# EAGLE design 612_jetracer_esp32s3_030009 (EAGLE 9.6.2)
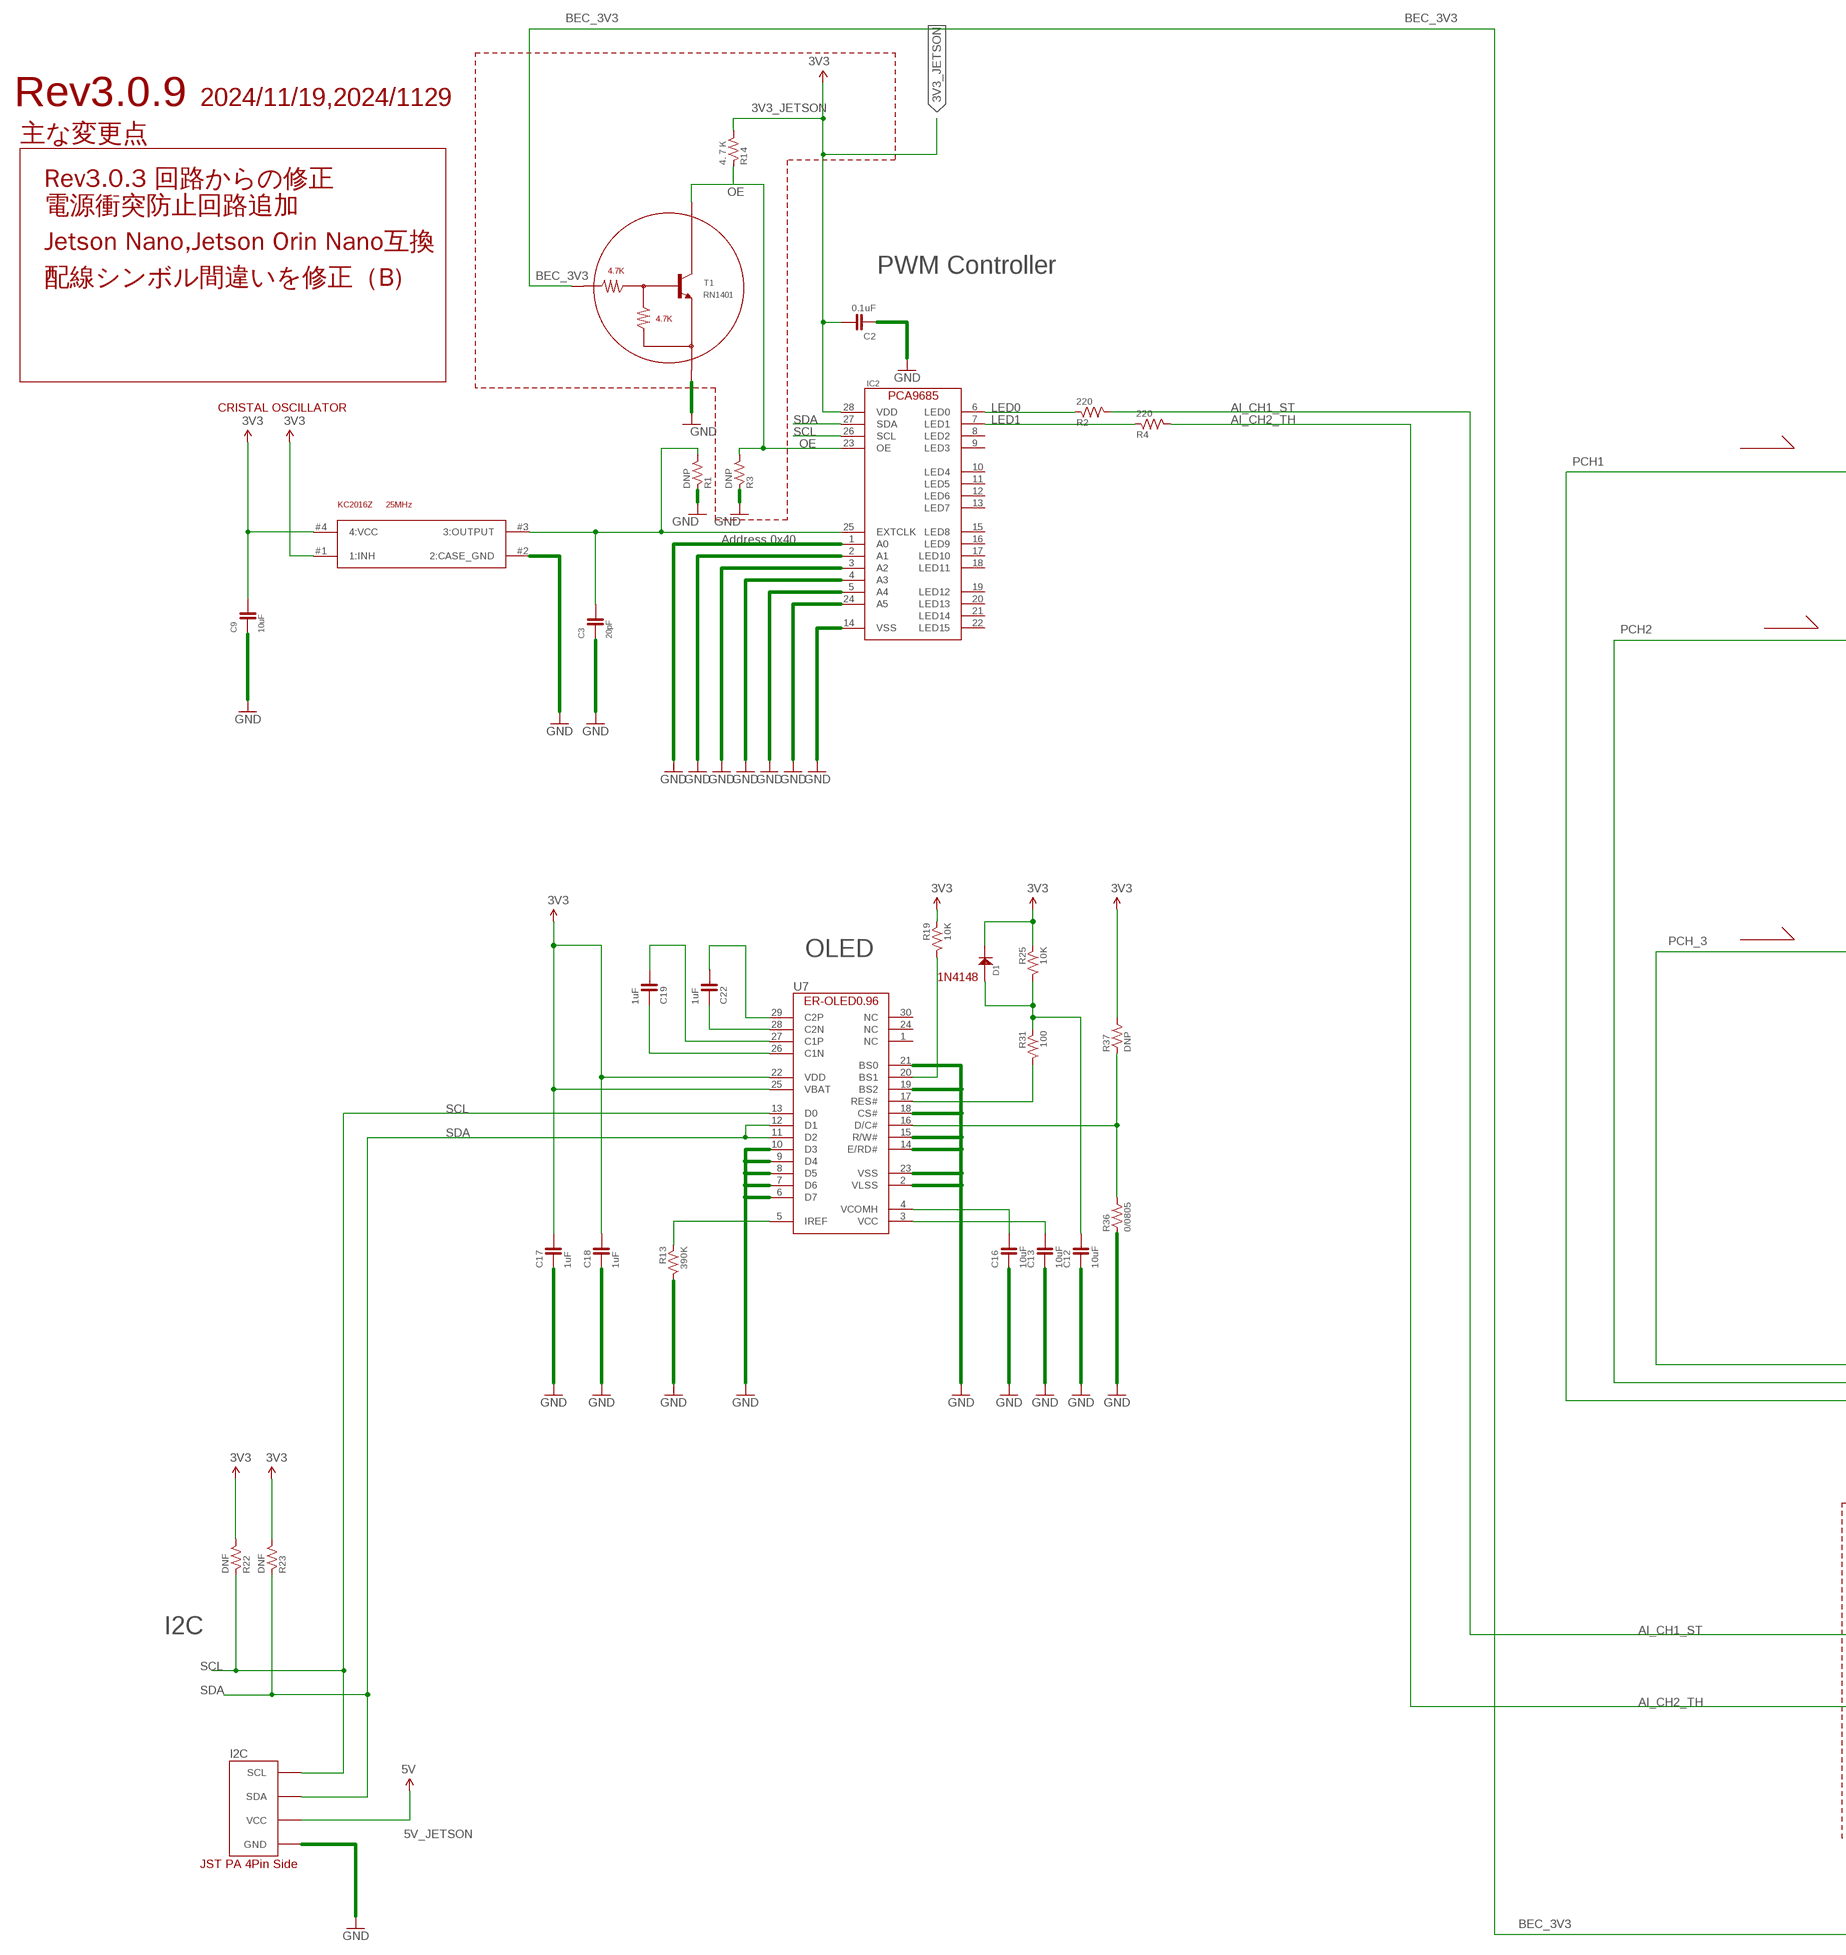
[diagram p0: schematic, sheet 1, part 1 of 3]
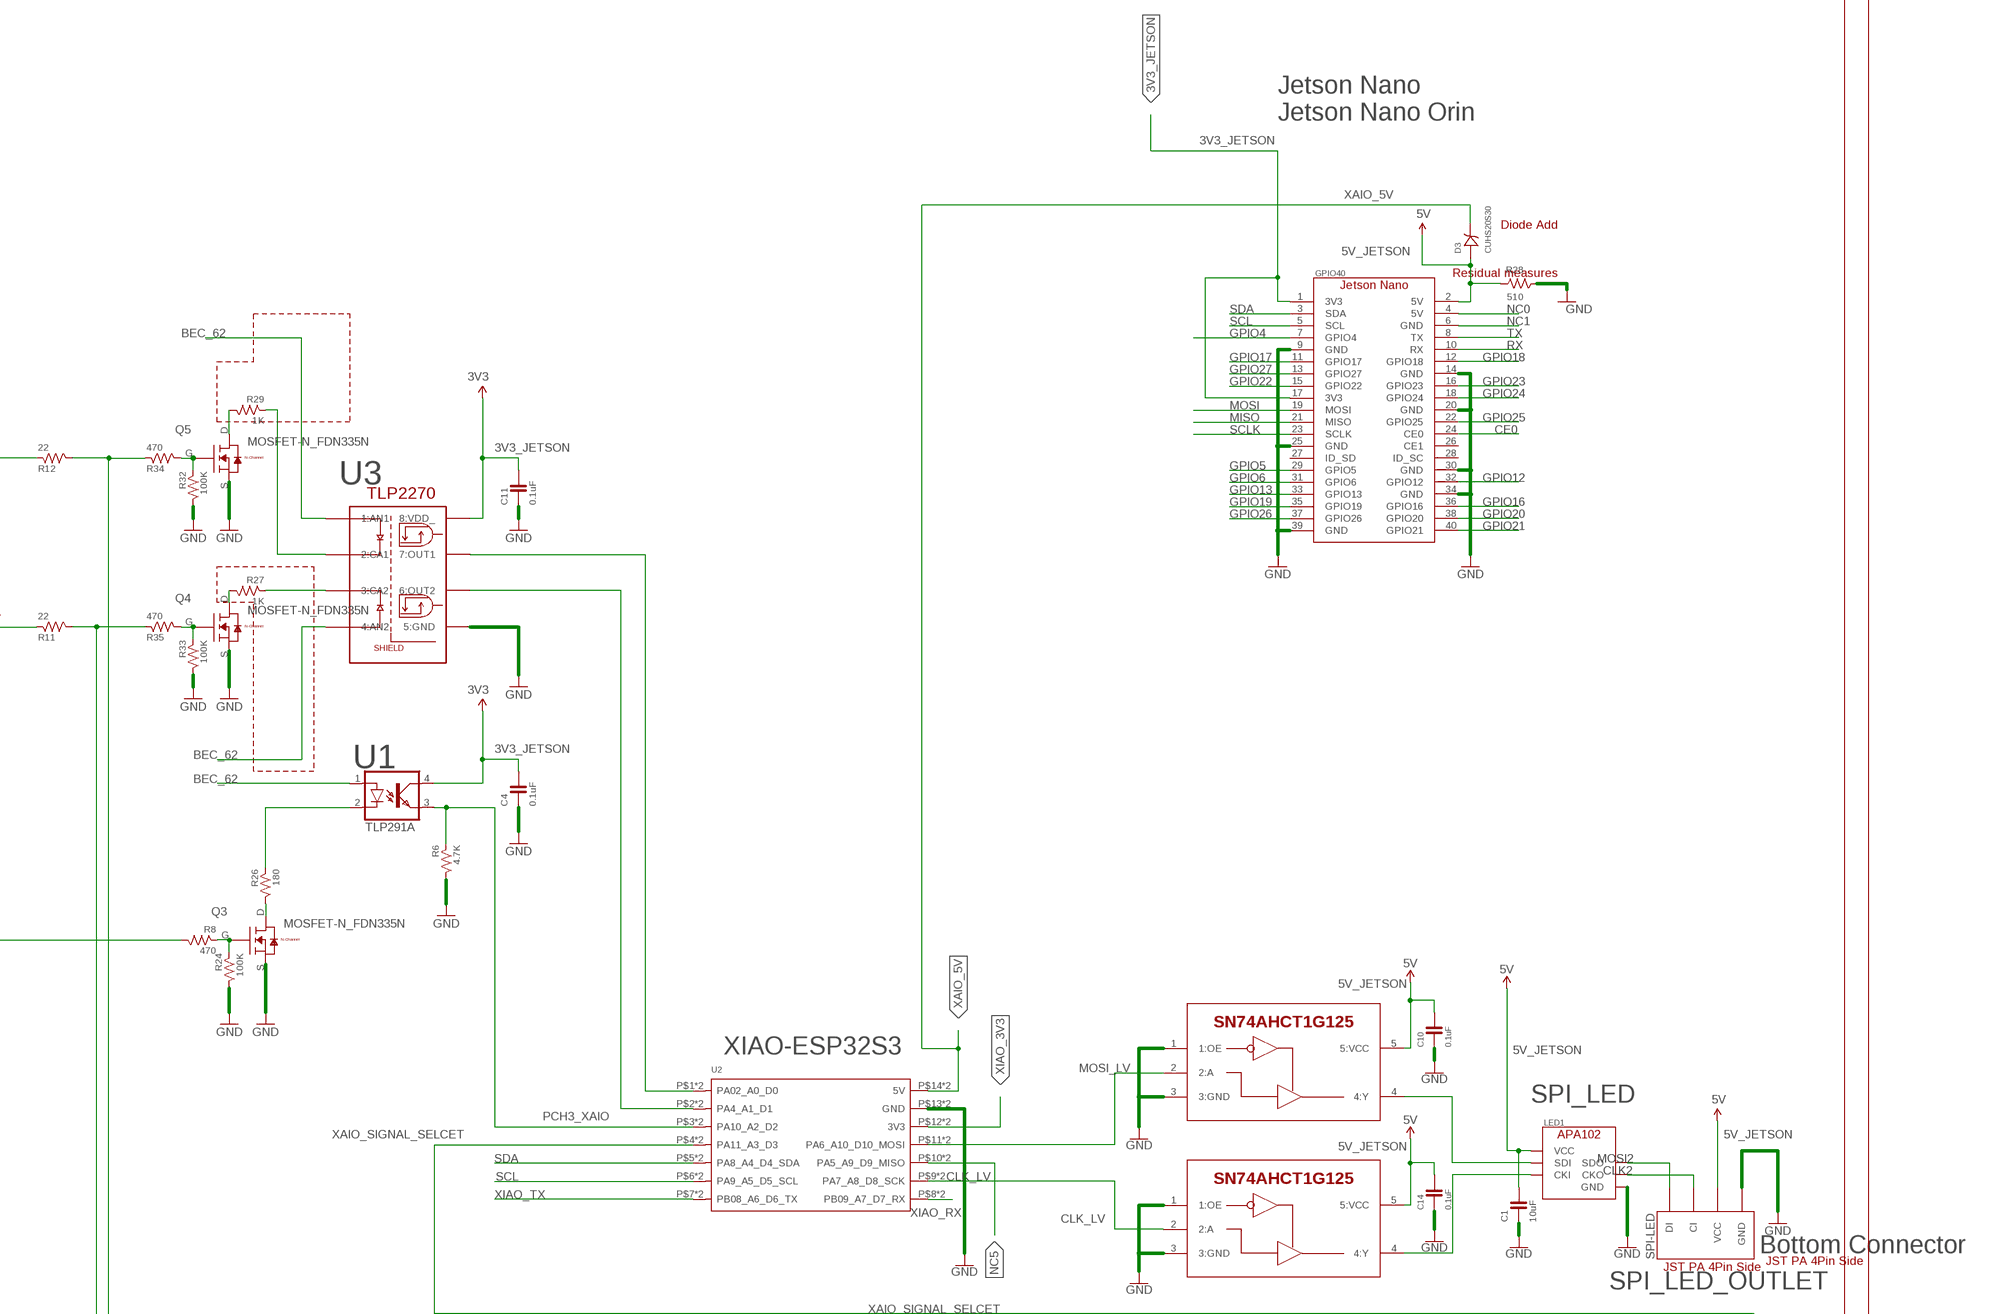
[diagram p1: schematic, sheet 1, part 2 of 3]
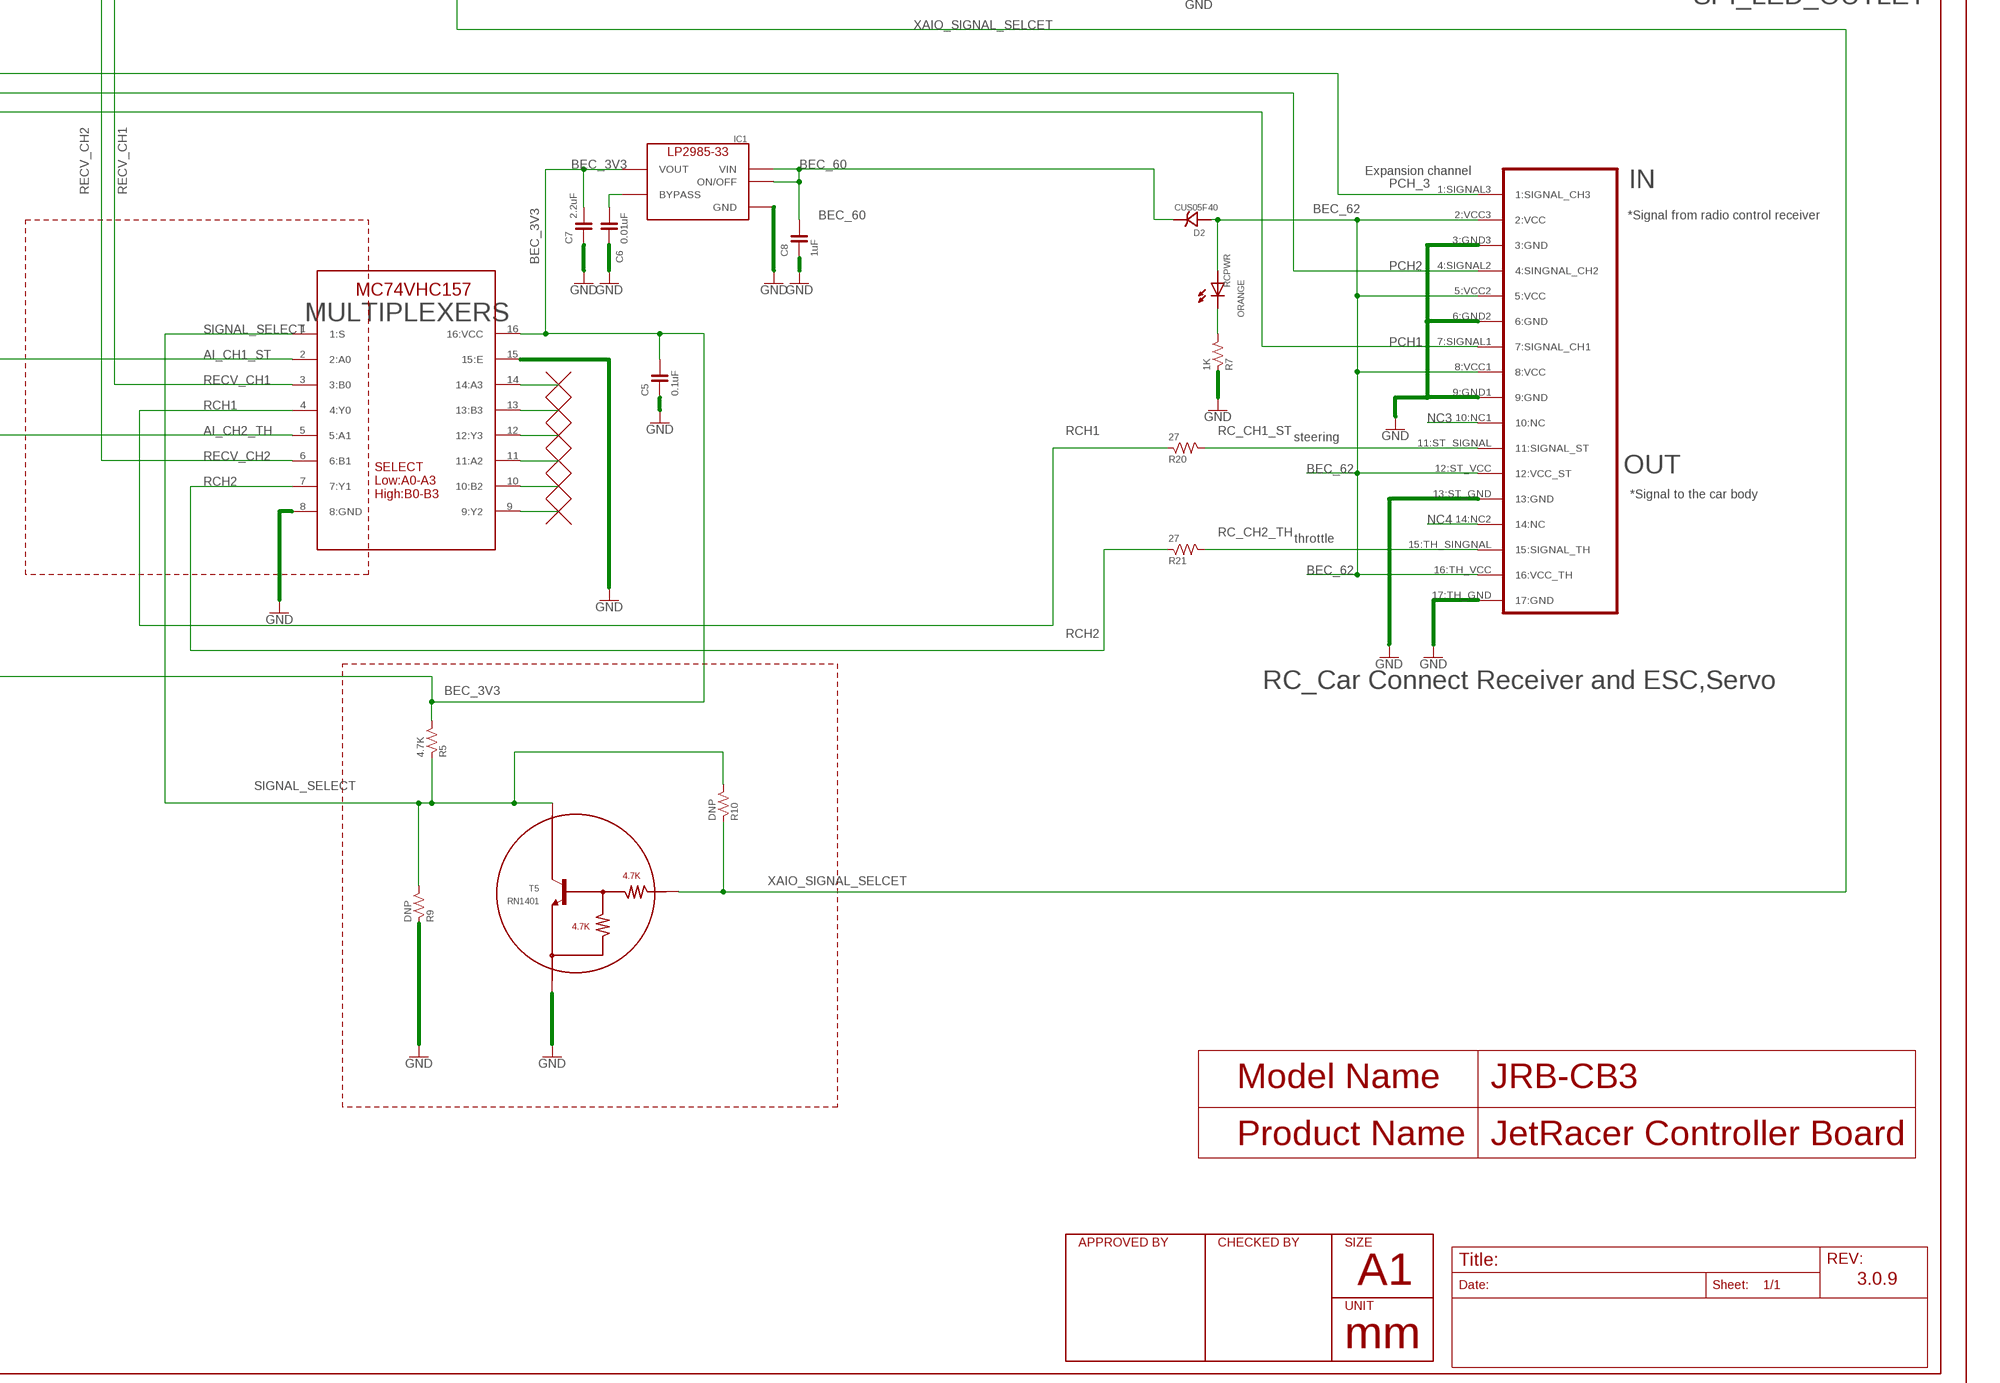
[diagram p2: schematic, sheet 1, part 3 of 3]

## Parts
C1  10uF  CAPACITOR-0603  [0603]
C2  0.1uF  CAPACITOR-0603  [0603]
C3  20pF  CAPACITOR-0402  [0402]
C4  0.1uF  CAPACITOR-0603  [0603]
C5  0.1uF  CAPACITOR-0603  [0603]
C6  0.01uF  CAPACITOR-0603  [0603]
C7  2.2uF  CAPACITOR-0603  [0603]
C8  1uF  CAPACITOR-0603  [0603]
C9  10uF  CAPACITOR-0402  [0402]
C10  0.1uF  CAPACITOR-0402  [0402]
C11  0.1uF  CAPACITOR-0603  [0603]
C12  10uF  CAPACITOR-0603  [0603]
C13  10uF  CAPACITOR-0603  [0603]
C14  0.1uF  CAPACITOR-0402  [0402]
C16  10uF  CAPACITOR-0603  [0603]
C17  1uF  CAPACITOR-0603  [0603]
C18  1uF  CAPACITOR-0603  [0603]
C19  1uF  CAPACITOR-0603  [0603]
C22  1uF  CAPACITOR-0603  [0603]
D1  1N4148  [1N4148W]
D2  CUS05F40  [CUS05F40]
D3  CUHS20S30  [US2H]
GPIO40  JETSON_NANOJETSON_NANO_OVERALL  [JETSON_NANO_DEMENTION]
I2C  FABO-I2C  [I2C-SM04B-PASS-1-FL]
IC1  LP2985-33DBVR  [SOT-23-5]
IC2  PCA9685PW,BS  [PCA9685]
LED1  APA102_IPIXEL  [APA102_2020]
Q3  MOSFET-N_FDN335N  [SUPERSOT-3]
Q4  MOSFET-N_FDN335N  [SUPERSOT-3]
Q5  MOSFET-N_FDN335N  [SUPERSOT-3]
R1  DNP  RESISTOR-0603  [0603]
R2  220  RESISTOR-0603  [0603]
R3  DNP  RESISTOR-0603  [0603]
R4  220  RESISTOR-0603  [0603]
R5  4.7K  RESISTOR-0603  [0603]
R6  4.7K  RESISTOR-0603  [0603]
R7  1K  RESISTOR-0603  [0603]
R8  470  RESISTOR-0603  [0603]
R9  DNP  RESISTOR-0603  [0603]
R10  DNP  RESISTOR-0603  [0603]
R11  22  RESISTOR-0603  [0603]
R12  22  RESISTOR-0603  [0603]
R13  390K  RESISTOR-0603  [0603]
R14  4.７K  RESISTOR-0603  [0603]
R19  10K  RESISTOR-0603  [0603]
R20  27  RESISTOR-0603  [0603]
R21  27  RESISTOR-0603  [0603]
R22  DNF  RESISTOR-0603  [0603]
R23  DNF  RESISTOR-0603  [0603]
R24  100K  RESISTOR-0603  [0603]
R25  10K  RESISTOR-0603  [0603]
R26  180  RESISTOR-0603  [0603]
R27  1K  RESISTOR-0603  [0603]
R28  510  RESISTOR-0805  [0805]
R29  1K  RESISTOR-0603  [0603]
R31  100  RESISTOR-0603  [0603]
R32  100K  RESISTOR-0603  [0603]
R33  100K  RESISTOR-0603  [0603]
R34  470  RESISTOR-0603  [0603]
R35  470  RESISTOR-0603  [0603]
R36  0/0805  RESISTOR-0805  [0805]
R37  DNP  RESISTOR-0805  [0805]
RCPWR  ORANGE  LED-0603  [0603]
SPI-LED  FABO-SPI-LED  [SPI-SM04B-PASS-1-FL]
T1  RN1401  [SC-59]
T5  RN1401  [SC-59]
U1  TLP291A  [11-3C1]
U2  MOUDLE-SEEEDUINO-XIAO-ESP32C3  [MOUDLE14P-DIP]
U3  TLP2270  [TLP2270]
U7  ER-OLED0.96-1ER-CON30HT-1  [ER-CON30HT-1]
U$1  RC_17PIN_OUTIN  [PNHEADER_2.54_SMT_17PIN_RC_TT01_02]
U$3  MC74VHC157  [MC74VHC157_TSSOP-16]
U$9  SN74AHCT1G125  [SOT-1DOT1]
U$10  SN74AHCT1G125  [SOT-1DOT1]
U$11  KC2016Z  [KC2016Z]

## Nets
3V3_JETSON: C2.2 C4.2 C9.2 C11.2 C17.2 C18.2 D1.CATHODE GPIO40.1(3V3) GPIO40.17(3V3) IC2.28(VDD) R14.2 R19.1 R22.2 R23.2 R25.1 R37.2 U1.4(COL) U3.8(8:VDD_) U7.22(VDD) U7.25(VBAT) U$11.#1(1:INH) U$11.#4(4:VCC) ; supply symbol labelled 3V3
5V_JETSON: C1.2 C10.2 C14.2 D3.A(ANODE) GPIO40.2(5V) I2C.5V(VCC) LED1.VCC R28.2 SPI-LED.5V(VCC) U$9.5(5:VCC) U$10.5(5:VCC) ; supply symbol labelled 5V
AI_CH1_ST: R2.2 U$3.2(2:A0)
AI_CH2_TH: R4.2 U$3.5(5:A1)
BEC_3V3: C5.2 C7.2 IC1.5(VOUT) R5.2 T1.B U$3.16(16:VCC)
BEC_60: C8.2 D2.C(CATHODE) IC1.1(VIN) IC1.3(ON/OFF)
BEC_62: D2.A(ANODE) RCPWR.ANODE U1.1(A) U3.1(1:AN1) U3.4(4:AN2) U$1.2:VCC3(2:VCC) U$1.5:VCC2(5:VCC) U$1.8:VCC1(8:VCC) U$1.12:ST_VCC(12:VCC_ST) U$1.16:TH_VCC(16:VCC_TH)
CE0: GPIO40.24(CE0)
CLK2: LED1.CKO SPI-LED.CI
CLK_HV: LED1.CKI U$10.4(4:Y)
CLK_LV: U2.P$9(PA7_A8_D8_SCK) U2.P$23(PA7_A8_D8_SCK) U$10.2(2:A)
GND: C1.1 C2.1 C3.1 C4.1 C5.1 C6.1 C7.1 C8.1 C9.1 C10.1 C11.1 C12.1 C13.1 C14.1 C16.1 C17.1 C18.1 GPIO40.9(GND) GPIO40.14(GND) GPIO40.20(GND) GPIO40.25(GND) GPIO40.30(GND) GPIO40.34(GND) GPIO40.39(GND) I2C.GND IC1.2(GND) IC2.1(A0) IC2.2(A1) IC2.3(A2) IC2.4(A3) IC2.5(A4) IC2.14(VSS) IC2.24(A5) LED1.GND Q3.S Q4.S Q5.S R1.1 R3.1 R6.2 R7.1 R9.1 R13.2 R24.2 R28.1 R32.2 R33.2 R36.1 SPI-LED.GND T1.E T5.E U2.P$13(GND) U2.P$27(GND) U3.5(5:GND) U7.2(VLSS) U7.6(D7) U7.7(D6) U7.8(D5) U7.9(D4) U7.10(D3) U7.14(E/RD#) U7.15(R/W#) U7.18(CS#) U7.19(BS2) U7.21(BS0) U7.23(VSS) U$1.3:GND3(3:GND) U$1.6:GND2(6:GND) U$1.9:GND1(9:GND) U$1.13:ST_GND(13:GND) U$1.17:TH_GND(17:GND) U$3.8(8:GND) U$3.15(15:E) U$9.1(1:OE) U$9.3(3:GND) U$10.1(1:OE) U$10.3(3:GND) U$11.#2(2:CASE_GND)
GPIO4: GPIO40.7(GPIO4)
GPIO5: GPIO40.29(GPIO5)
GPIO6: GPIO40.31(GPIO6)
GPIO12: GPIO40.32(GPIO12)
GPIO13: GPIO40.33(GPIO13)
GPIO16: GPIO40.36(GPIO16)
GPIO17: GPIO40.11(GPIO17)
GPIO18: GPIO40.12(GPIO18)
GPIO19: GPIO40.35(GPIO19)
GPIO20: GPIO40.38(GPIO20)
GPIO21: GPIO40.40(GPIO21)
GPIO22: GPIO40.15(GPIO22)
GPIO23: GPIO40.16(GPIO23)
GPIO24: GPIO40.18(GPIO24)
GPIO25: GPIO40.22(GPIO25)
GPIO26: GPIO40.37(GPIO26)
GPIO27: GPIO40.13(GPIO27)
LED0: IC2.6(LED0) R2.1
LED1: IC2.7(LED1) R4.1
MISO: GPIO40.21(MISO)
MOSI: GPIO40.19(MOSI)
MOSI2: LED1.SDO SPI-LED.DI
MOSI_HV: LED1.SDI U$9.4(4:Y)
MOSI_LV: U2.P$11(PA6_A10_D10_MOSI) U2.P$25(PA6_A10_D10_MOSI) U$9.2(2:A)
N$2: U$3.9(9:Y2)
N$3: C22.2 U7.29(C2P)
N$4: U$3.10(10:B2)
N$5: U2.P$1(PA02_A0_D0) U2.P$15(PA02_A0_D0) U3.7(7:OUT1)
N$6: R26.1 U1.2(C)
N$8: U2.P$2(PA4_A1_D1) U2.P$16(PA4_A1_D1) U3.6(6:OUT2)
N$14: R13.1 U7.5(IREF)
N$16: C19.2 U7.27(C1P)
N$17: C13.2 U7.3(VCC)
N$18: R31.2 U7.17(RES#)
N$19: U$3.11(11:A2)
N$20: U$3.12(12:Y3)
N$21: C19.1 U7.26(C1N)
N$22: C22.1 U7.28(C2N)
N$23: Q3.G R8.1 R24.1
N$24: R7.2 RCPWR.CATHODE
N$25: C16.2 U7.4(VCOMH)
N$26: Q3.D R26.2
N$27: Q4.D R27.2
N$28: R27.1 U3.3(3:CA2)
N$29: Q5.D R29.2
N$30: R29.1 U3.2(2:CA1)
N$31: U$3.13(13:B3)
N$32: C12.2 D1.ANODE R25.2 R31.1
N$33: Q5.G R32.1 R34.2
N$35: U$3.14(14:A3)
N$37: R36.2 R37.1 U7.16(D/C#)
N$38: Q4.G R33.1 R35.2
N$40: C6.2 IC1.4(BYPASS)
N$41: C3.2 IC2.25(EXTCLK) R1.2 U$11.#3(3:OUTPUT)
N$50: R19.2 U7.20(BS1)
NC0: GPIO40.4(5V)
NC1: GPIO40.6(GND)
NC3: U$1.10:NC1(10:NC)
NC4: U$1.14:NC2(14:NC)
NC5: U2.P$10(PA5_A9_D9_MISO) U2.P$24(PA5_A9_D9_MISO)
OE: IC2.23(OE) R3.2 R14.1 T1.C
PCH1: R12.1 U$1.7:SIGNAL1(7:SIGNAL_CH1)
PCH2: R11.1 U$1.4:SIGNAL2(4:SINGNAL_CH2)
PCH3_XAIO: R6.1 U1.3(EMI) U2.P$3(PA10_A2_D2) U2.P$17(PA10_A2_D2)
PCH_3: R8.2 U$1.1:SIGNAL3(1:SIGNAL_CH3)
RC_CH1_ST: R20.2 U$1.11:ST_SIGNAL(11:SIGNAL_ST)
RC_CH2_TH: R21.2 U$1.15:TH_SINGNAL(15:SIGNAL_TH)
RCH1: R20.1 U$3.4(4:Y0)
RCH2: R21.1 U$3.7(7:Y1)
RECV_CH1: R12.2 R34.1 U$3.3(3:B0)
RECV_CH2: R11.2 R35.1 U$3.6(6:B1)
RX: GPIO40.10(RX)
SCL: GPIO40.5(SCL) I2C.SCL IC2.26(SCL) R22.1 U2.P$6(PA9_A5_D5_SCL) U2.P$20(PA9_A5_D5_SCL) U7.13(D0)
SCLK: GPIO40.23(SCLK)
SDA: GPIO40.3(SDA) I2C.SDA IC2.27(SDA) R23.1 U2.P$5(PA8_A4_D4_SDA) U2.P$19(PA8_A4_D4_SDA) U7.11(D2) U7.12(D1)
SIGNAL_SELECT: R5.1 R9.2 R10.2 T5.C U$3.1(1:S)
TX: GPIO40.8(TX)
XAIO_5V: D3.K(CATHODE) U2.P$14(5V) U2.P$28(5V)
XAIO_SIGNAL_SELCET: R10.1 T5.B U2.P$4(PA11_A3_D3) U2.P$18(PA11_A3_D3)
XIAO_3V3: U2.P$12(3V3) U2.P$26(3V3)
XIAO_RX: U2.P$8(PB09_A7_D7_RX) U2.P$22(PB09_A7_D7_RX)
XIAO_TX: U2.P$7(PB08_A6_D6_TX) U2.P$21(PB08_A6_D6_TX)
Unconnected: GPIO40.26(CE1) GPIO40.27(ID_SD) GPIO40.28(ID_SC) IC2.8(LED2) IC2.9(LED3) IC2.10(LED4) IC2.11(LED5) IC2.12(LED6) IC2.13(LED7) IC2.15(LED8) IC2.16(LED9) IC2.17(LED10) IC2.18(LED11) IC2.19(LED12) IC2.20(LED13) IC2.21(LED14) IC2.22(LED15) U7.1(NC) U7.24(NC) U7.30(NC)

## Notes on the sheet
- Rev3.0.9 | 2024/11/19,2024/1129
- Jetson Nano
  Jetson Nano Orin
- 主な変更点
- Rev3.0.3 回路からの修正
  電源衝突防止回路追加
- Diode Add
- Jetson Nano,Jetson Orin Nano互換
- PWM Controller
- 配線シンボル間違いを修正（B)
- Residual measures
- CRISTAL OSCILLATOR
- Address 0x40
- OLED
- 1N4148
- XIAO-ESP32S3
- SPI_LED
- Bottom Connector
- JST PA 4Pin Side
- JST PA 4Pin Side
- SPI_LED_OUTLET
- Expansion channel
- IN
- *Signal from radio control receiver
- MULTIPLEXERS
- I2C
- steering
- OUT
- *Signal to the car body
- SELECT
  Low:A0-A3
  High:B0-B3
- throttle
- JST PA 4Pin Side
- RC_Car Connect Receiver and ESC,Servo
- Model Name | JRB-CB3
- Product Name | JetRacer Controller Board
- 3.0.9

## Library data of the parts
C1-C14 C16-C19 C22 = FaBo-Capacitor:CAPACITOR: CAPACITOR
D1 = FaBo-Diode:1N4148
D2 = FaBo-Diode:CUS05F40
D3 = FaBo-Diode:CUHS20S30: 30V,2A,temp-50~150,if 0.25V(0.5A),rev 170uA(10V)
GPIO40 = FaBo-Boards:JETSON_NANO
I2C = FaBo-Connetor:FABO-I2C
IC1 = FaBo-Supply:LP2985-33DBVR: LP2985
IC2 = FaBo-Motor:PCA9685PW,BS
LED1 = FaBo-LED:APA102
Q3-Q5 = FaBo-Mosfet:MOSFET-N
R1-R4 R6-R14 R19-R29 R31-R36 = FaBo-Resistors:RESISTOR: RESISTOR
R5 R37 = FaBo-Resistors:RESISTOR: RESISTOR; SPICEPREFIX: R
RCPWR = FaBo-LED:LED
SPI-LED = FaBo-Connetor:FABO-SPI-LED
T1 T5 = FaBo-Transistor:RN1401
U1 = FaBo_Photocoupler:TLP291A
U2 = FaBo-MPU:MOUDLE-SEEEDUINO-XIAO-ESP32C3
U3 = FaBo-Photocoupler:TLP2270
U7 = FaBo-Display:ER-OLED0.96-1: ER-CON30HT-1 Rev2 wide distance 0.23mm
U$1 = FaBo-PIN:RC_17PIN_OUTIN
U$3 = FaBo-Multiplexers:MC74VHC157
U$9 U$10 = FaBo-LogicIC:SN74AHCT1G125: Input TTL logic level level shift
U$11 = FaBo-Crystal:KC2016Z

## Board
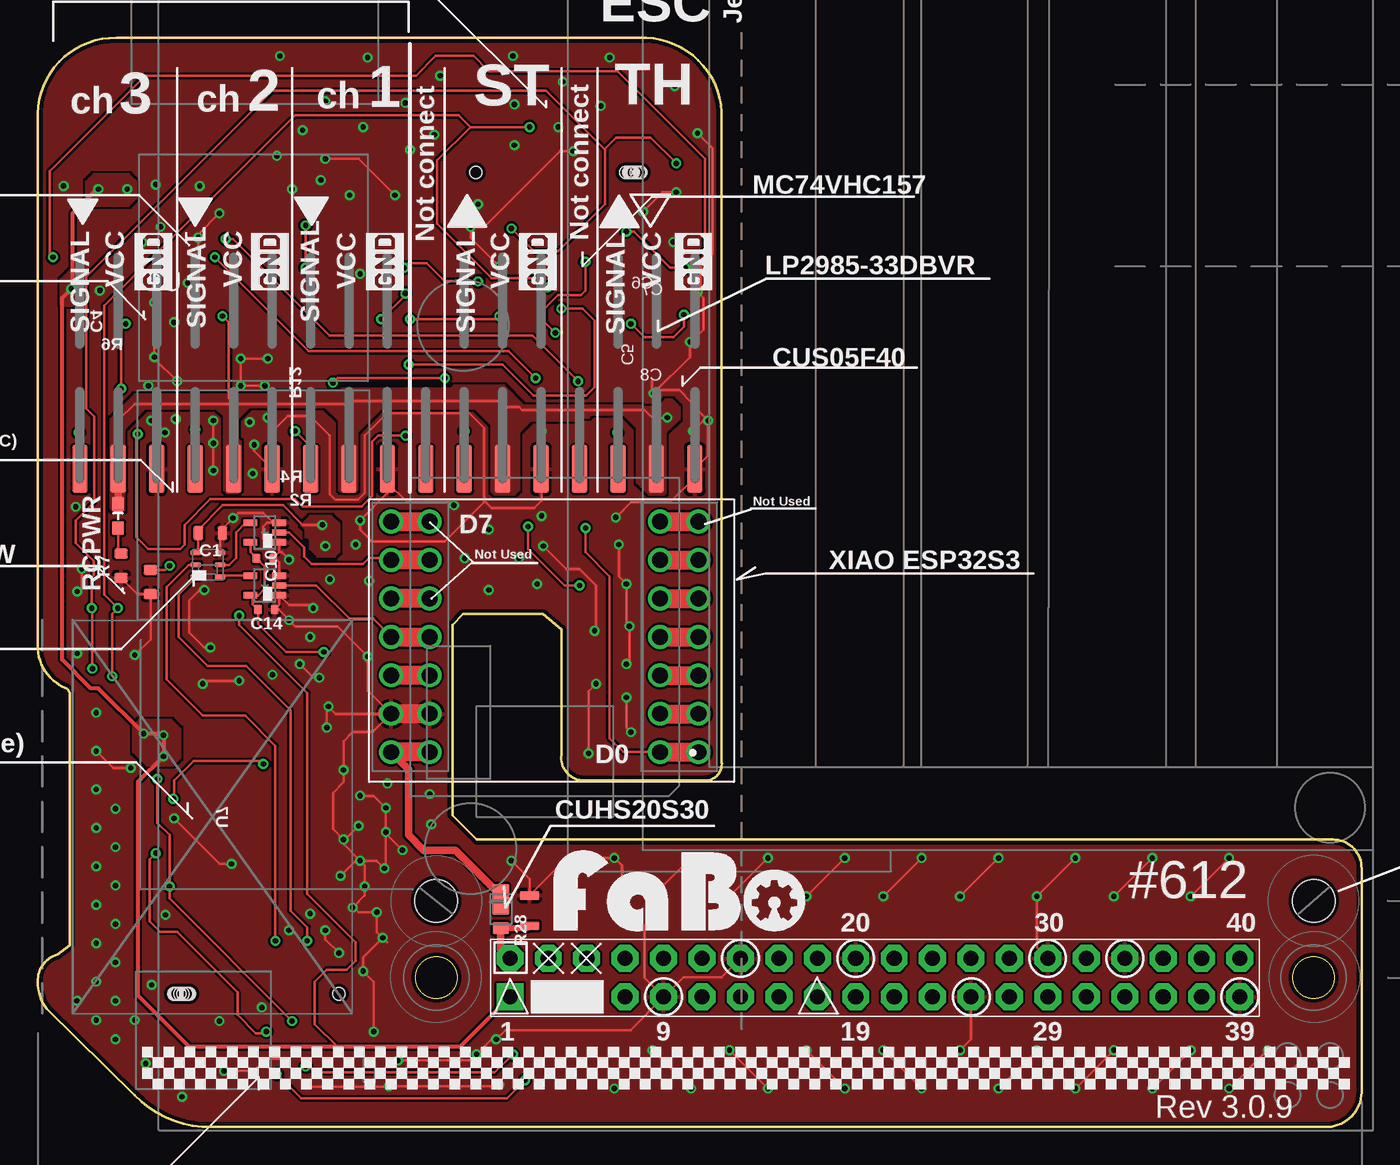
[diagram p3: board, top side]
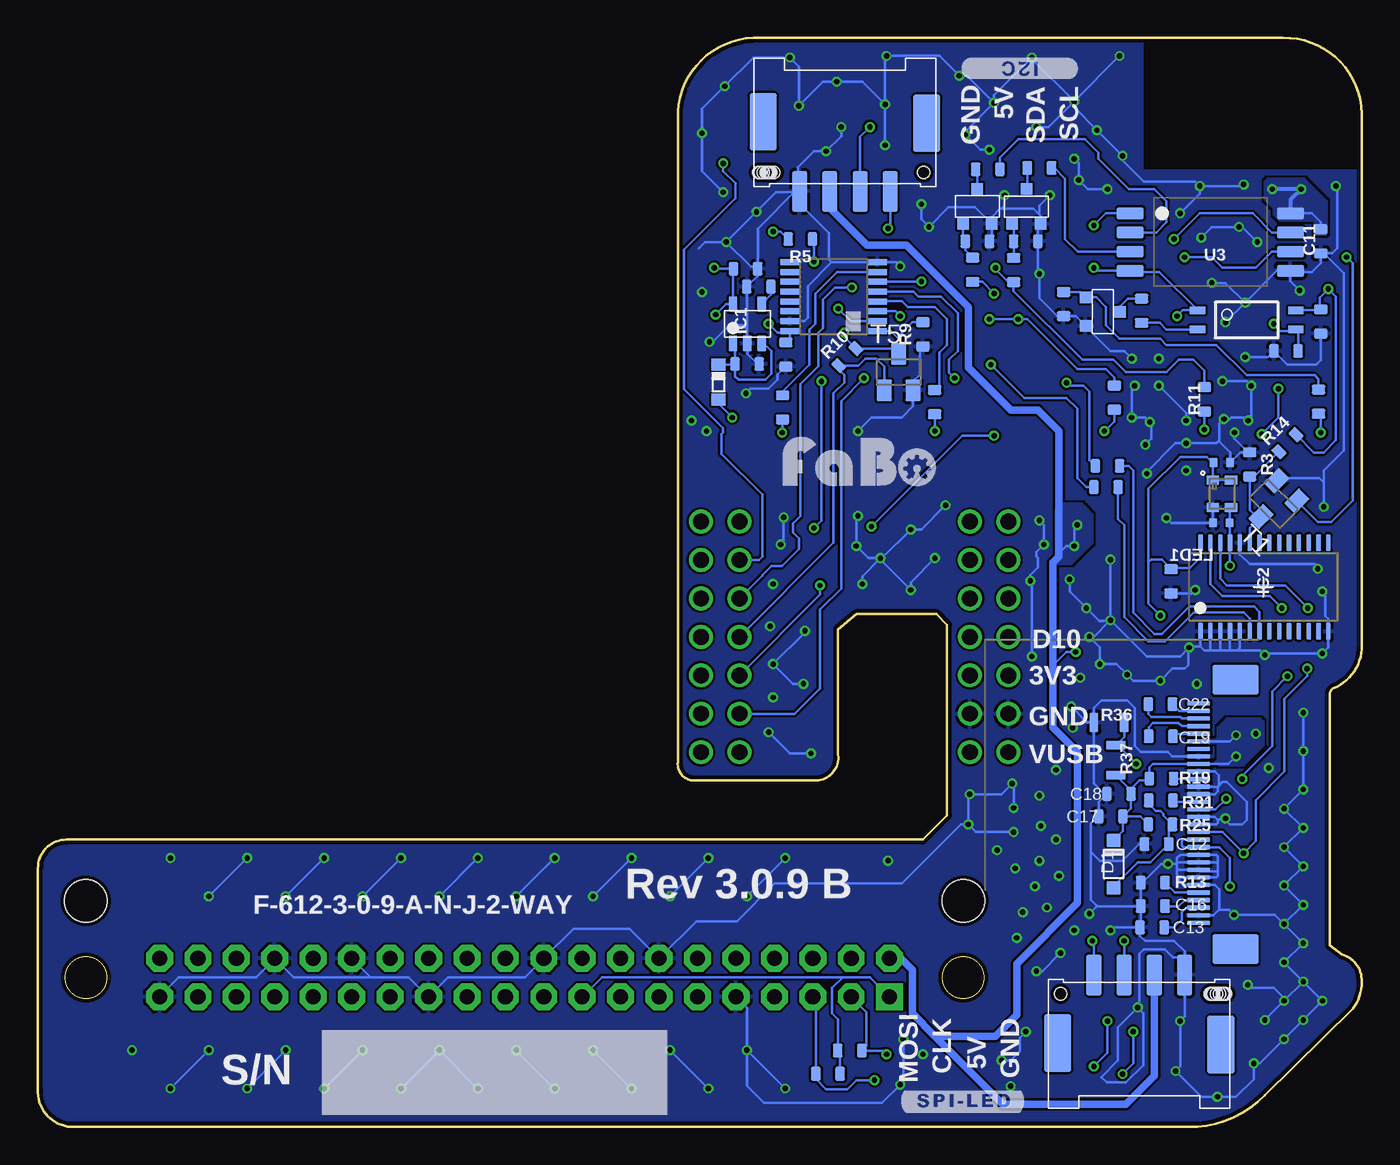
[diagram p4: board, bottom side, seen from below]

Size 87.51 x 72 mm. Coordinates in mm from the lower left corner, seen from the top.
Outline: 45.2,24.1 45.2,67.1 arc84 40.2,72 5.2,72 arc90 0,67 0,31.6 arc67 1.9,29 2,28.9 2.1,28.7 2.1,12 1.3,11.4 arc80 0,9.6 arc39 0.6,7.8 6.4,2.1 arc48 11.5,0 85.3,0 arc90 87.5,2.5 87.5,17.1 arc90 85.6,19 29,19 27.4,20.6 27.4,33.2 28.1,33.9 33.4,33.9 34.6,32.9 34.6,24.6 arc99 36.2,22.9 44.1,22.9 arc95 45.2,24.1
Copper layers (1*16): Top 0.035mm / dielectric 1.6mm / Bottom 0.035mm
Design rules "PCBway": minimum track width 6mil, minimum drill 12mil, track to track 6mil, track to pad 6mil, pad to pad 6mil, via to via 6mil, smd to smd 6mil, copper to edge 10mil, drill to drill 10mil, minimum pad ring 10mil, minimum via ring 6mil, stop-mask expansion 2mil, vias tented up to drill 100mil, thermal gap 8mil
Holes 2.8 mm at 84.33,14.95 26.33,14.94
bRestrict: area -0.3,63.3 to 14.4,85.7; 7 lines

### Footprints (pad centres in the part's own frame; a part is rotated, then mirrored left to right if it is on the bottom)
0603 = smd 0.65 x 0.9: 1 -0.8,0; 2 0.8,0
0402 = smd 0.5 x 0.6: 1 -0.55,0; 2 0.55,0
1N4148W = smd 0.9 x 0.95: ANODE 0,0; CATHODE 3.15,0
CUS05F40 = smd 0.8 x 0.9: A -1.15,0; C 1.15,0
US2H = smd 0.8 x 1.1: A 1.25,0 | smd 2 x 1.1: K -0.65,0
JETSON_NANO_DEMENTION = drill 1 pad 1.778 square: 1 0,0 | drill 1 pad 1.778 octagon: 2 0,2.54; 3 2.54,0; 4 2.54,2.54; 5 5.08,0; 6 5.08,2.54; 7 7.62,0; 8 7.62,2.54; 9 10.16,0; 10 10.16,2.54; 11 12.7,0; 12 12.7,2.54; 13 15.24,0; 14 15.24,2.54; 15 17.78,0; 16 17.78,2.54; 17 20.32,0; 18 20.32,2.54; 19 22.86,0; 20 22.86,2.54; 21 25.4,0; 22 25.4,2.54; 23 27.94,0; 24 27.94,2.54; 25 30.48,0; 26 30.48,2.54; 27 33.02,0; 28 33.02,2.54; 29 35.56,0; 30 35.56,2.54; 31 38.1,0; 32 38.1,2.54; 33 40.64,0; 34 40.64,2.54; 35 43.18,0; 36 43.18,2.54; 37 45.72,0; 38 45.72,2.54; 39 48.26,0; 40 48.26,2.54
I2C-SM04B-PASS-1-FL = smd 1 x 2.7: 5V -1,0; GND -3,0; SCL 3,0; SDA 1,0 | smd 1.8 x 3.8: P$5 -5.4,4.6; P$6 5.4,4.5 | hole 0.8: 5.2,1.25; -4.7,1.25; -5.7,1.25; -5.6,1.25; -5.4,1.25; -5.2,1.25; -5.1,1.25; -5,1.25; -4.9,1.25
SOT-23-5 = smd 0.6 x 1.05: 1 -0.95,-1.3; 2 0,-1.3; 3 0.95,-1.3; 4 0.95,1.3; 5 -0.95,1.3
PCA9685 = smd 0.3 x 1.1: 1 -4.15,-2.93; 2 -3.5,-2.93; 3 -2.85,-2.93; 4 -2.2,-2.93; 5 -1.55,-2.93; 6 -0.9,-2.93; 7 -0.25,-2.93; 8 0.4,-2.93; 9 1.05,-2.93; 10 1.7,-2.93; 11 2.35,-2.93; 12 3,-2.93; 13 3.65,-2.93; 14 4.3,-2.93; 15 4.3,2.92; 16 3.65,2.92; 17 3,2.92; 18 2.35,2.92; 19 1.7,2.92; 20 1.05,2.92; 21 0.4,2.92; 22 -0.25,2.92; 23 -0.9,2.92; 24 -1.55,2.92; 25 -2.2,2.92; 26 -2.85,2.92; 27 -3.5,2.92; 28 -4.15,2.92
APA102_2020 = smd 0.7 x 0.35: CKI 0.8,0; CKO -0.8,0; GND 0.8,0.8; SDI 0.8,-0.8; SDO -0.8,-0.8; VCC -0.8,0.8
SUPERSOT-3 = smd 0.76 x 0.76: D 0,1.15; G -0.95,-1.15; S 0.95,-1.15
0805 = smd 0.6 x 1.3: 1 -1,0; 2 1,0
0603' = smd 0.9 x 0.8: ANODE -0.8,0; CATHODE 0.8,0
SPI-SM04B-PASS-1-FL = smd 1 x 2.7: 5V -1,-0.1; CI 1,-0.1; DI 3,-0.1; GND -3,-0.1 | smd 1.8 x 3.8: P$5 -5.4,4.5; P$6 5.4,4.4 | hole 0.8: 5.2,1.15; -4.7,1.15; -5.7,1.15; -4.8,1.15; -4.9,1.15; -5.1,1.15; -5.3,1.15; -5.5,1.15; -5.6,1.15
SC-59 = smd 1 x 1.4: B -0.95,-1.2; C 0,1.2; E 0.95,-1.2
11-3C1 = smd 1 x 0.5: 1 -3.24,0.635; 2 -3.24,-0.635; 3 3.24,-0.635; 4 3.24,0.635
MOUDLE14P-DIP = drill 1.05: P$1 1.27,18.12; P$2 1.27,15.58; P$3 1.27,13.04; P$4 1.27,10.5; P$5 1.27,7.96; P$6 1.27,5.42; P$7 1.27,2.88; P$8 16.51,2.88; P$9 16.51,5.42; P$10 16.51,7.96; P$11 16.51,10.5; P$12 16.51,13.04; P$13 16.51,15.58; P$14 16.51,18.12; P$15 -1.27,18.12; P$16 -1.27,15.58; P$17 -1.27,13.04; P$18 -1.27,10.5; P$19 -1.27,7.96; P$20 -1.27,5.42; P$21 -1.27,2.88; P$22 19.05,2.88; P$23 19.05,5.42; P$24 19.05,7.96; P$25 19.05,10.5; P$26 19.05,13.04; P$27 19.05,15.58; P$28 19.05,18.12
TLP2270 = smd 0.8 x 1.8: 1 -1.905,-5.3; 2 -0.635,-5.3; 3 0.635,-5.3; 4 1.905,-5.3; 5 1.905,5.3; 6 0.635,5.3; 7 -0.635,5.3; 8 -1.905,5.3
ER-CON30HT-1 = smd 0.3 x 1.5 bottom: 1 7,-0.23; 2 6.5,-0.23; 3 6,-0.23; 4 5.5,-0.23; 5 5,-0.23; 6 4.5,-0.23; 7 4,-0.23; 8 3.5,-0.23; 9 3,-0.23; 10 2.5,-0.23; 11 2,-0.23; 12 1.5,-0.23; 13 1,-0.23; 14 0.5,-0.23; 15 0,-0.23; 16 -0.5,-0.23; 17 -1,-0.23; 18 -1.5,-0.23; 19 -2,-0.23; 20 -2.5,-0.23; 21 -3,-0.23; 22 -3.5,-0.23; 23 -4,-0.23; 24 -4.5,-0.23; 25 -5,-0.23; 26 -5.5,-0.23; 27 -6,-0.23; 28 -6.5,-0.23; 29 -7,-0.23; 30 -7.5,-0.23 | smd 2 x 3 bottom: 31 -9.07,-2.67; 32 8.74,-2.67
PNHEADER_2.54_SMT_17PIN_RC_TT01_02 = smd 1.02 x 3.17: 1:SIGNAL3 -20.32,0; 2:VCC3 -17.78,0; 3:GND3 -15.24,0; 4:SIGNAL2 -12.7,0; 5:VCC2 -10.16,0; 6:GND2 -7.62,0; 7:SIGNAL1 -5.08,0; 8:VCC1 -2.54,0; 9:GND1 0,0; 10:NC1 2.54,0; 11:ST_SIGNAL 5.08,0; 12:ST_VCC 7.62,0; 13:ST_GND 10.16,0; 14:NC2 12.7,0; 15:TH_SINGNAL 15.24,0; 16:TH_VCC 17.78,0; 17:TH_GND 20.32,0
MC74VHC157_TSSOP-16 = smd 1.26 x 0.36: 1 -2.9,2.275; 2 -2.9,1.625; 3 -2.9,0.975; 4 -2.9,0.325; 5 -2.9,-0.325; 6 -2.9,-0.975; 7 -2.9,-1.625; 8 -2.9,-2.275; 9 2.9,-2.275; 10 2.9,-1.625; 11 2.9,-0.975; 12 2.9,-0.325; 13 2.9,0.325; 14 2.9,0.975; 15 2.9,1.625; 16 2.9,2.275
SOT-1DOT1 = smd 0.4 x 0.95: 1 -0.65,-0.95; 2 0,-0.95; 3 0.65,-0.95; 4 0.65,0.95; 5 -0.65,0.95
KC2016Z = smd 0.6 x 0.8: #1 -0.9,-0.6; #2 0.9,-0.6; #3 0.9,0.6; #4 -0.9,0.6

### Placement (x,y rotation side)
C1  11.4,39.27 180 top
C2  12.6,36.07 90 bottom
C3  9.27,39.94 0 bottom
C4  2.7,53.25 90 bottom
C5  38.06,51.07 90 bottom
C6  39.85,55.56 0 bottom
C7  40.73,56.73 180 bottom
C8  40.62,50.44 180 bottom
C9  9.24,43.93 180 bottom
C10  15,37.6 180 top
C11  2.7,58.55 90 bottom
C12  13.55,18.7 0 bottom
C13  13.85,13.2 0 bottom
C14  15.1,34.2 180 top
C16  13.8,14.6 0 bottom
C17  16.58,20.53 0 bottom
C18  16.04,22.02 0 bottom
C19  13.28,25.83 180 bottom
C22  13.3,27.95 0 bottom
D1  16.4,15.8 90 bottom
D2  42.52,49.25 90 bottom
D3  30.6,14.4 270 top
GPIO40  31.2,8.6 0 top
I2C  34.15,61.85 0 bottom
IC1  40.6,53.1 0 bottom
IC2  6.5,35.7 0 bottom
LED1  11.24,37.16 0 top
Q3  17.1,53.9 270 bottom
Q4  22.16,60.85 0 bottom
Q5  25.4,60.85 0 bottom
R1  7.45,36.03 90 top
R2  16.9,42.3 180 bottom
R3  7.4,43.8 270 bottom
R4  16.8,43.7 180 bottom
R5  37.1,58.7 180 bottom
R6  5,51.3 180 bottom
R7  5.5,37.1 90 top
R8  2.85,47.95 270 bottom
R9  29,52.4 90 bottom
R10  34,50.9 45 bottom
R11  10.4,48.1 90 bottom
R12  16.35,48.22 90 bottom
R13  13.8,16.15 180 bottom
R14  4.9,45.2 45 bottom
R19  13.23,23.03 0 bottom
R20  28.23,47.92 270 bottom
R21  38.28,47.57 270 bottom
R22  35.28,3.52 0 bottom
R23  33.83,5.05 180 bottom
R24  19.7,54.4 270 bottom
R25  13.3,20 0 bottom
R26  14.54,53.96 90 bottom
R27  21.3,63.4 180 bottom
R28  32.5,14.3 270 top
R29  24.71,63.31 180 bottom
R31  13.28,21.58 0 bottom
R32  25.4,58.55 0 bottom
R33  22.2,58.55 0 bottom
R34  25.71,56.67 90 bottom
R35  23.01,56.65 90 bottom
R36  16.7,26.75 0 bottom
R37  16.25,24.25 270 bottom
RCPWR  ORANGE  [0603']  5.3,40.4 270 top
SPI-LED  14.7,9.95 180 bottom
T1  5.8,41.2 135 bottom
T5  30.6,49.9 0 bottom
U1  7.6,53.35 0 bottom
U2  42.4,42.9 180 top
U3  10,58.5 270 bottom
U7  11,20.5 270 top
U$1  23.1,43.5 0 top
U$2  [LOGO_FABO_L]  41.7,12.95 0 top
U$3  34.9,54.9 180 bottom
U$5  [LOGO_SILK_GND]  16.6,55.3 90 top
U$6  [LOGO_SILK_GND]  24.2,55.3 90 top
U$7  [LOGO_SILK_GND]  34.3,55.3 90 top
U$8  [LOGO_SILK_GND]  44.6,55.3 90 top
U$9  15,35.8 90 top
U$10  15,39.3 90 top
U$11  9.23,41.86 270 bottom
U$12  [LOGO_SILK_GND]  8.9,55.3 90 top
U$13  [LOGO_FABO_M_BOTTOM]  33.2,42 0 top

### Tracks (layer width: path | path; a pad name or v marks a point on that pad's centre or on a via)
3V3_JETSON  (via drill 0.35)
  Top 0.152: 30.8,8.2 GPIO40.1 | v13.3,33.8 13.3,33.2 17.8,28.7 17.8,15.4 21,12.2 21,11 20.4,10.4 19.1,10.4 18.3,9.6 18.3,6.8 19.8,5.3
  Top 0.254: GPIO40.1 27.9,5.3 19.8,5.3 10,5.3 6.6,8.7 6.6,22.8 v8.3,24.5 v8.3,25.9 8.2,26 v7,26 4,29 3.5,29 1.6,30.9 1.6,54.8 v2.2,55.4 2.3,55.5 2.3,60.4 3.95,62.05 v4,62
  Bottom 0.152: U3.8 3.31,60.41 2.7,59.8 C11.2 | 4.33,54.02 U1.4 2.77,53.98 | R22.2 34.48,4.9 R23.2 34.63,7.13 35,7.5 35,9.2 34.3,9.9 | GPIO40.1 32.5,9.9 34.3,9.9 | U$11.#4 U$11.#1 9.83,43.89 | 9.83,43.89 C9.2 | 2.77,53.98 C4.2 | v8.3,25.9 8.71,25.5 U7.25 | v8.3,24.5 8.81,24 U7.22 13.81,24 14.03,23.77 R19.1 14.17,22.9 14.7,22.9 15.24,22.36 C18.2 | 2.77,53.98 2.77,54.84 v2.2,55.4 1.7,54.9 1.7,45.4 2.5,44.6 3.17,44.6 R14.2 | v13.3,33.8 14.1,34.6 14.1,37.3 | R37.2 15.24,22.24 C18.2 | C17.2 15.24,21.07 C18.2 | R25.1 14.63,20.53 C17.2 | D1.CATHODE 15.78,19.57 C17.2 | 34.3,9.9 50.22,9.9 GPIO40.17 | 9.83,43.89 10.24,44.3 12,44.3 14.1,42.2 14.1,37.3 | 12.84,37.11 12.66,36.94 | 12.66,36.94 C2.2 13.23,37.5 13.9,37.5 14.1,37.3 | IC2.28 10.65,37.65 11.36,36.94 12.66,36.94
  Bottom 0.254: U3.8 4.7,61.3 v4,62 v5.9,62
  pour Bottom (no thermals): 6.5,25.2 6.5,26.8 6.7,27 8.9,27 9.5,26.4 9.5,25.8 9.7,25.6 10.1,25.6 10.1,25.4 9.5,25.4 9.5,24.3 9.7,24.1 9.6,24 9.5,24 9.4,23.9 7.8,23.9
  pour Bottom (no thermals): 2.3,59.1 2.3,61.2 3.8,62.7 6.2,62.7 6.4,62.5 6.4,61.3 5.8,60.7 5.8,60.3 5.4,59.9 3.2,59.9 3.1,59.8 3.1,59 2.4,59
  pour Top (no thermals): 3.2,61.1 3.2,62.5 3.4,62.7 3.7,63 5.7,63 6,63 6.4,62.6 6.5,62.5 6.5,61.4 6,60.9 5.6,60.9 3.4,60.9
  pour Top (no thermals): 1.5,54.4 1.5,56 2.25,56.75 2.8,56.2 2.8,54.8 2.3,54.3 1.6,54.3
  pour Top (no thermals): 6.3,24.8 6.3,26.5 6.7,26.9 8.8,26.9 9.4,26.3 9.4,24.4 8.9,23.9 7.2,23.9
5V_JETSON  (via drill 0.35)
  Top 0.152: U$10.5 14.05,38 C10.2 15,37.05 15,35.6 14.55,35.15 14.2,35.15 | 14.2,35.15 U$9.5 | 14.2,35.15 14.2,34.55 C14.2 14.55,33.25 16.4,31.4 v18.9,31.4 | v18.8,39.8 17.5,39.8 16.2,41.1 12.23,41.1 10.6,39.47 C1.2 10.6,38.12 LED1.VCC
  Top 0.406: D3.A 32.35,13.15 R28.2
  Top 0.508: 30.7,13.25 D3.A 30.6,11.74 GPIO40.2
  Bottom 0.152: v18.9,31.4 19.5,31.4 20.4,30.5 | v18.8,39.8 19,39.6 v19,38.4 19.5,38.4 20,37.9
  Bottom 0.508: I2C.5V 35.15,60.75 32.7,58.3 30.1,58.3 26,54.2 26,50.2 23.2,47.4 21.4,47.4 20,46 20,37.9 20,37.7 20.4,37.3 20.4,30.5 20.4,26.4 18.8,24.8 18.8,14.8 22.8,10.8 22.8,7.4 24.2,6 28.2,6 | 31.4,11.14 GPIO40.2 30.44,11.14 29.7,10.4 29.7,7.5 28.2,6 | SPI-LED.5V 13.7,3.4 15.6,1.5 23.7,1.5 28.2,6
  pour Bottom (no thermals): 20.1,37.2 19.2,37.2 17.9,38.5 17.8,38.6 17.8,40.4 17.8,40.5 18.3,41 18.5,41.2 19.8,41.2 20.2,40.8 20.2,40.7 20.2,37.3
  pour Top (no thermals): 17.7,39 17.7,39.5 17.4,39.8 18,40.4 19.4,40.4 19.9,39.9 19.9,38 19.6,37.7 18.5,37.7 18,38.2 18,38.8 17.8,39
AI_CH1_ST  (via drill 0.35)
  Top 0.152: v24.5,50.4 30.7,50.4 32.76,48.34 36.25,48.34 36.8,48.9 36.8,53.3 36,54.1 v34.6,54.1
  Bottom 0.152: R2.2 18.2,42.3 18.8,42.9 18.8,47.5 19.5,48.2 22.3,48.2 v24.5,50.4 | v34.6,54.1 33.77,53.27 U$3.2
AI_CH2_TH  (via drill 0.35)
  Top 0.152: v26.9,49.5 19.8,49.5 v19.5,49.2
  Bottom 0.152: v26.9,49.5 27.29,49.88 27.29,50.72 26.7,51.3 26.7,53.8 27.8,54.9 29.3,54.9 29.62,55.22 U$3.5 | v19.5,49.2 19.3,49 18.4,49 18,48.6 18,44.1 R4.2
BEC_3V3  (via drill 0.35)
  Top 0.152: v39.2,53.1 40.1,52.2 42,52.2 42.7,52.9 v42.7,53.7 | v38.9,59.2 39.4,59.2 41.8,56.8 v42.8,56.8 44.1,58.1 44.1,64 38.3,69.8 29.8,69.8 28.8,70.8 26.3,70.8 25,69.5 7.1,69.5 0.8,63.2 0.8,57.7 v1,57.5
  Bottom 0.152: C7.2 41.55,56.7 IC1.5 42,54.4 v42.7,53.7 | U$3.16 37.8,52.52 | 37.8,52.52 38.62,52.52 v39.2,53.1 | 41.4,56.85 C7.2 | C5.2 37.8,52.12 37.8,52.52 | R5.2 38.4,59.2 v38.9,59.2 | v42.8,56.8 42.74,56.73 C7.2 | T1.B 2.91,40 2,40 0.6,41.4 0.6,57.1 v1,57.5
BEC_60
  Bottom 0.152: C8.2 41.42,51.67 IC1.1 | C8.2 41.42,49.62 41.2,49.4 39.4,49.4 39,49.8 39,51.3 39.5,51.8 IC1.3 | C8.2 41.47,50.4 D2.C
BEC_62  (via drill 0.35)
  Top 0.152: U$1.2:VCC3 5.32,46.72 6.4,47.8 12.6,47.8 | 12.6,47.8 13,47.8 | 13,47.8 20.2,47.8 20.25,47.75 | 30.72,47.6 31.8,47.6 32,47.4 40.1,47.4 40.88,46.62 40.88,46.5 | 40.88,46.5 U$1.16:TH_VCC | 20.25,47.75 20.56,47.44 U$1.8:VCC1 | 40.88,46.5 41.28,46.9 v41.6,46.9 | v12.2,53.6 12.6,53.2 12.6,48.2 13,47.8 | 30.72,47.6 30.72,47.78 30.5,48 20.5,48 20.25,47.75 | U$1.12:ST_VCC 30.72,47.6 | 12.6,47.8 12.94,47.46 U$1.5:VCC2 | v17.7,56.8 v17.7,59.6
  Top 0.508: U$1.2:VCC3 5.32,41.22 RCPWR.ANODE
  Bottom 0.152: v41.6,46.9 42.52,47.81 D2.A | v12.2,53.6 11.82,53.98 U1.1 13.38,56.52 15.38,56.52 U3.4 17.5,56.59 v17.7,56.8 | 15.37,60.47 U3.1 16.9,60.41 v17.7,59.6
  pour Top (no thermals): 4.8,46.8 4.8,40.9 5,40.7 5.6,40.7 5.7,40.8 5.7,46.1 7.1,47.5 11.8,47.5 12.3,47 12.3,42.1 12.5,41.9 13.2,41.9 13.4,42.1 13.4,45.3 13.2,45.5 13.2,46.8 14,47.6 19,47.6 19.9,46.7 19.9,42.1 20,42 21,42 21.1,42.1 21.1,45.9 22.7,47.5 28.9,47.5 30,46.4 30,42 30.2,41.8 31.5,41.8 31.8,42.1 31.8,45.9 32.6,46.7 35.6,46.7 35.8,46.9 36.4,46.9 36.6,47.1 38.7,47.1 39.6,46.2 39.6,42.6 40.4,41.8 41.4,41.8 41.5,41.9 41.5,45.9 42.4,46.8 42.4,47.6 41.9,48.1 41.5,48.1 41,47.6 40,47.6 39.9,47.7 32.1,47.7 30.8,49 27.5,49 27.3,48.8 20.1,48.8 19.9,48.6 15.7,48.6 15.5,48.4 6.4,48.4
CLK2  (via drill 0.35)
  Top 0.152: LED1.CKO 9.96,37.16 8.5,35.7 8.5,29.6 10.9,27.2 13.7,27.2 15.7,25.2 v15.7,12.3
  Bottom 0.152: SPI-LED.CI v15.7,12.3
CLK_HV
  Top 0.152: LED1.CKI 12.66,37.16 13.1,37.6 13.1,39.3 13.75,39.95 U$10.4
CLK_LV
  Top 0.152: U$10.2 16.6,39.3 17.6,38.3 17.6,37.7 18.1,37.2 21.5,37.2 21.9,37.6 23.23,37.6 U2.P$23
  Top 1.27: U2.P$9 U2.P$23 23.33,37.5
GND  (via drill 0.35)
  Top 0.152: LED1.GND 12.04,39.11 C1.1 12.2,39.55 v12.9,40.25 13.25,40.6 14.9,40.6 15.55,39.95 U$10.3 15.15,39.95 14.9,39.7 14.9,38.9 15.15,38.65 U$10.1 15.95,38 | v33.3,46 33.3,43.54 | 33.3,43.54 U$1.13:ST_GND | R1.1 7.22,35 | R7.1 6.58,35.23 R1.1 | R1.1 7.45,32.24 v6.4,31.2 | v7.7,54.5 v7.7,50.9 7.7,50.8 v9.2,49.3 | v35.4,64.5 34.5,64.5 29.5,59.5 v28.6,59.5 28.6,58.8 v30.5,56.9 | v44.3,46.7 44.3,44.38 U$1.17:TH_GND 43.42,42.92 41.8,41.3 39.2,41.3 v38.2,40.3 | 15.95,38 15.63,37.67 | 15.63,37.67 C10.1 | U$9.3 15.95,37.35 15.63,37.67 | v16.6,37.5 16.1,38 15.95,38 | U$1.9:GND1 23.1,42.1 | U2.P$27 21.8,28.87 v21.8,31.1 19.8,33.1 17,33.1 v16.6,33.5 15.9,34.2 C14.1 15.95,34.5 U$9.1 16.6,34.5 18,34.5 v18.2,34.3 | U2.P$27 23.1,27.32 19.68,27.32 19.25,27.75 | 19.25,27.75 v19.2,27.8 | U2.P$27 22.13,26.1 20.8,26.1 20.2,25.5 v20.2,23.6 20.2,22.8 19.5,22.1 19.5,19.7 20.15,19.05 | 29.5,41.4 30,40.9 32.8,40.9 33.3,41.4 33.3,43.54 | 29.5,41.4 29.5,46.2 28.5,47.2 23.1,47.2 21.6,45.7 21.6,41.91 21.18,41.49 19.65,41.49 19.3,41.83 19.3,45.7 18,47 16.5,47 15.48,45.98 U$1.6:GND2 14.3,44.68 v14.3,45.1 | 11.5,31.7 v11.4,31.7 11,31.7 10,32.7 10,34.8 10.7,35.5 v11,35.5 | v15.2,50.8 v13.4,50.8 v13.4,49 v15,49 | 29.5,41.4 29.5,41.3 26.9,38.7 22.1,38.7 21.3,39.5 v21.3,40.1 23.1,41.9 U$1.9:GND1 | v2.9,36.9 2.9,35.7 v2.6,35.4 | v23.6,61.6 21.2,64 v19,64 | v9,20.4 12.01,17.4 v12.8,17.4 | v11.6,46.7 v11.6,45.2 v11.6,43.4 | v7.5,46.7 7.6,46.7 v8.4,45.9 7.86,45.36 U$1.3:GND3 | U$1.9:GND1 23.1,42.6 24.4,41.3 27.3,41.3 v27.5,41.1 | v40,60.5 41.3,61.8 v42.2,61.8 | v6.13,23.74 4.97,23.74 v3.86,24.85 | v12,60.4 10.6,59 v10.6,58.8 10.6,56.5 v9.9,55.8
  Top 0.152: v22.2,6.3 22.2,9.6 v21.5,10.3 21.5,11.2 v22.8,12.5 | v23.8,4.4 28.6,4.4 v29,4.8 30,5.8 v30.3,5.8 30.9,6.4 39.16,6.4 GPIO40.9 | v38.9,30.6 39.1,30.8 v39.1,33.1 38.9,33.3 v38.9,35.9 38.4,36.4 v38.4,38.5 | v33.4,38.4 34.9,36.9 35.8,36.9 36.9,35.8 36.9,32.9 v36.8,32.8 | v18.6,29.7 18.2,29.7 v17.3,30.6 | v36.4,24.7 36.4,28.8 v36.9,29.3 | v39.2,26.1 38.9,26.4 v38.9,28.4 | v10.9,29.3 11.1,29.5 v13.3,29.5 | v21.3,17.6 21.6,17.3 v21.6,15.9 21.6,15.3 v20.8,14.5 20.8,14.6 21.2,14.2 v22.4,14.2 22.4,12.9 v22.8,12.5 | v21.3,17.6 22.4,17.6 v22.9,17.1 23,17.2 v23,19.5 | 20.15,19.05 v20.2,19 20.2,18.7 v21.3,17.6 | v20,16.6 21,17.6 v21.3,17.6 | v43.3,46 44,46.7 v44.3,46.7 | v44.3,46.7 43.2,47.8 43.2,47.9 42.4,48.7 40.9,48.7 v40.7,48.5 | 23.1,12.2 v22.8,12.5 | v19.9,11.5 19,12.4 v19,13 | v23,19.5 v23,21.1 22.2,21.9 v21.3,21.9 | v12.3,3.7 14.3,3.7 15.1,4.5 16.1,4.5 17.95,2.65 23.15,2.65 v23.2,2.7 30.4,2.7 v30.5,2.8 | GPIO40.9 40.1,9.86 40.1,13.3 38.6,14.8 38.6,17.28 v38.1,17.78 34.98,17.78 R28.1 32.5,16.4 v31.3,17.6 | GPIO40.9 42.66,9.9 45.2,9.9 GPIO40.14 | v43.6,65.7 44.6,64.7 44.6,57.7 43.8,56.9 43.8,55.4 v43.6,55.2 44,54.8 44,52.7 43.2,51.9 v43.1,51.9 43.1,50.9 v40.7,48.5 | 40.6,49.3 40.6,48.6 v40.7,48.5 | GPIO40.30 66.04,11.86 v66.04,15.24 v68.58,17.78 | v63.5,17.78 v60.96,15.24 | v58.42,17.78 v55.88,15.24 | v53.34,17.78 v50.8,15.24 | v48.26,17.78 v45.72,15.24 | v43.18,17.78 v40.64,15.24 | v71.12,15.24 v73.66,17.78 | v76.2,15.24 v78.74,17.78 | GPIO40.25 61.68,5.8 v60.96,5.08 | v58.42,2.54 v55.88,5.08 | v53.34,2.54 v50.8,5.08 | v48.26,2.54 v45.72,5.08 | v43.18,2.54 v40.64,5.08 | v63.5,2.54 v66.04,5.08
  Top 0.152: v68.58,2.54 v71.12,5.08 | v73.66,2.54 v76.2,5.08 | v78.74,2.54 v81.28,5.08 | v19.1,26.4 19.1,27.6 19.25,27.75 | v21.2,19.9 20.35,19.05 20.15,19.05 | v24.1,18.3 23,19.4 v23,19.5
  Top 1.27: U2.P$13 23.1,27.32
  Bottom 0.152: R32.2 24.45,58.7 Q5.S | U3.5 4.61,56.5 3.3,56.5 2.7,57.1 C11.1 2.5,57.75 | v12.9,40.25 12.59,39.94 C3.1 U$11.#2 | U$11.#2 | IC2.5 8.05,31.65 8.2,31.5 | 8.2,31.5 8.7,31.5 | 8.7,31.5 9.3,31.5 | 9.3,31.5 9.9,31.5 | 9.9,31.5 10.4,31.5 10.65,31.75 | 10.65,31.75 IC2.1 | IC2.2 10,31.6 9.9,31.5 | IC2.3 9.35,31.55 9.3,31.5 | IC2.4 8.7,31.5 | 8.2,31.5 6.7,31.5 v6.4,31.2 6.3,31.3 v2.6,31.3 2.2,31.7 IC2.14 2.2,33.57 2.4,33.77 2.4,35.2 v2.6,35.4 | C4.1 2.7,50.7 3,50.4 4.9,50.4 R6.2 6.2,50.9 v7.7,50.9 | v7.7,54.5 5.61,56.59 U3.5 | Q5.S 24.45,60.15 23.9,60.7 23.8,60.7 | 21.3,60.3 21.21,60.2 Q4.S 21.4,59.5 R33.2 21.4,56.5 v21.3,56.4 21.3,54.8 20.1,53.6 R24.2 18.9,53.6 Q3.S 16.6,51.3 15.7,51.3 v15.2,50.8 | 21.3,60.3 21.7,60.7 23.8,60.7 | U$3.15 36.83,53.27 36.6,53.5 36.6,55.6 35.03,57.17 | 39.78,56.88 C7.1 39.94,56.71 39.94,56.26 C6.1 40.64,52.7 | 37.25,62.05 39.9,59.4 39.9,56.88 40.38,56.88 v42,58.5 | Q5.S 25.55,60.8 27.3,60.8 v28.6,59.5 29.1,60 v29.1,61 | 37.25,62.05 37.25,63.45 36.2,64.5 v35.4,64.5 34.4,65.5 v34.4,66.1 | 37.25,62.05 37.25,61.75 I2C.GND 37.15,61.8 | v30.5,56.9 30.77,57.17 U$3.8 35.03,57.17 | C2.1 11.23,35.27 v11,35.5 | 10.65,31.75 11.4,31.75 v11.4,31.7 11.45,31.65 | v16.6,33.5 16.55,33.45 | 16.55,33.45 14.2,31.1 12,31.1 11.45,31.65 | v19.2,27.8 18.15,26.75 R36.1 | v14.3,45.1 13.9,45.5 13.9,46.5 v14,46.6 14.3,46.9 v15.2,46.9 15.2,48.8 v15,49 | v9.2,49.3 7.6,49.3 v7.3,49 7.3,46.9 v7.5,46.7 7.7,46.9 8.6,46.9 8.7,46.8 v9.1,46.8 9.4,46.5 9.4,45.4 9.45,45.35 | IC2.24 8.05,37.85 7.4,37.2 3.1,37.2 2.9,37 v2.9,36.9 | 23.8,60.7 23.6,60.9 v23.6,61.6 | C18.1 16.93,21.93 | 16.93,21.93 17.38,21.48 17.38,20.6
  Bottom 0.152: 17.38,20.6 C17.1 | C16.1 R13.2 14.5,16.15 13.26,17.4 v12.8,17.4 12.2,17.4 | C16.1 14.6,13.25 C13.1 | 9.5,16.9 9.5,16.6 9.61,16.5 U7.7 12,16.5 12.05,16.55 | 9.5,16.9 9.5,17.4 | 9.5,17.4 9.5,17.9 9.6,18 U7.10 12,18 12.2,17.8 12.2,17.5 | 9.5,17.4 9.6,17.5 U7.9 12.2,17.5 | 9.5,16.9 10.68,16.9 U7.8 12.1,17 12.2,17.1 | 12.2,17.5 12.2,17.4 | 12.2,17.4 12.2,17.1 | 12.2,17.1 12.2,16.7 12.05,16.55 | C12.1 14.7,18.7 15.8,17.6 17.3,17.6 17.9,18.2 | 17.9,18.2 17.9,20.08 17.38,20.6 | C16.1 17.5,14.6 17.55,14.65 | 17.55,14.65 17.9,15 17.9,18.2 | R36.1 17.7,22.7 16.93,21.93 | 11.7,11.2 SPI-LED.GND 11.7,7.3 v12,7 12,4 v12.3,3.7 10.6,2 v9.53,2 8.3,2 7.13,3.17 v7.13,4.2 6.73,4.2 v5.13,5.8 v3.86,7.07 v2.59,8.34 v3.86,9.61 | 11.7,11.2 11.7,11.6 12.4,12.3 14.3,12.3 14.65,12.65 C13.1 | 9.45,14.35 9.4,14.4 9.4,15.7 9.7,16 U7.6 11.8,16 12.05,16.25 12.05,16.55 | 9.45,14.35 9.81,14 U7.2 | U7.14 9.61,20 9.5,20.1 9.5,20.3 9.55,20.35 | 9.55,20.35 9.7,20.5 U7.15 | 9.55,20.35 9.05,20.35 | 9.05,20.35 v9,20.4 | U7.23 12.5,24.5 12.8,24.8 14.6,24.8 15,25.2 15,27.7 15.5,28.2 17.2,28.2 17.7,27.7 R36.1 | v16.6,37.5 v16.6,33.5 | 16.55,33.45 17.35,33.45 v18.2,34.3 19.3,35.4 v19.3,36.2 | 9.05,20.35 8.7,20 7.9,20 7.6,20.3 7.6,21.5 8.9,22.8 9.2,22.8 9.45,22.55 | 9.51,22.5 U7.19 | 9.45,22.55 9.51,22.5 | U7.18 9.71,22 9.51,22.2 9.51,22.5 | 9.45,22.55 9.45,23.25 9.7,23.5 U7.21 | v14.2,43.2 14.2,43.3 12.3,45.2 v11.6,45.2 9.6,45.2 9.45,45.35 | v21.8,31.1 21.8,36 v21.9,36.1 21.9,36.5 21.4,37 21.4,37.6 21.5,37.7 21.5,38 v21,38.5 21,39.8 v21.3,40.1 | v27.5,41.1 29.1,39.5 v29.8,39.5 31.7,37.6 v31.8,37.6 | v31.8,37.6 31.8,37.5 v29.8,35.5 29.8,36 v28.2,37.6
  Bottom 0.152: v16,70.8 v19,67.8 | v19,67.8 21.8,70.6 v21.8,70.7 24.3,68.2 v24.3,67.7 | v24.3,67.7 26.1,69.5 v26.6,69.5 27.9,70.8 v31.4,70.8 31.5,70.7 v31.5,67.6 | v31.5,67.6 33,69.1 v34.7,69.1 35.6,69.1 v37.2,67.5 37.2,70.1 v37.8,70.7 40.2,70.7 v42.1,68.8 43.6,67.3 v43.6,65.7 43.6,63.2 v42.2,61.8 | v31.5,64.9 v31.5,67.6 | v42,58.5 v40,60.5 38.7,61.8 37.15,61.8 | 2.5,57.75 1.95,57.75 1.6,58.1 1.6,62.1 v1.7,62.2 | v3.86,27.39 v3.86,24.85 v3.86,22.31 v5.13,21.04 v3.86,19.77 v5.13,18.5 v3.86,17.23 v5.13,15.96 v3.86,14.69 v5.13,13.42 | U3.5 4.7,55.9 v4.1,55.3 | v6.9,58.5 7.9,59.5 v8.1,59.5 9.9,59.5 v10.6,58.8 | v12,60.4 10.7,61.7 v10.7,62.2 | v10.7,62.2 7.9,62.2 v7.8,62.3 | v10.7,62.2 11,62.5 14.4,62.5 15.8,63.9 v15.8,64.2 v17.5,65.9 19,67.4 v19,67.8 | v19,67.8 20.7,66.1 v21.5,66.1 | v24.3,67.7 26.2,65.8 v26.2,65.6 25.2,64.6 v24.6,64.6 | v3.86,9.61 v5.13,10.88 v3.86,12.15 v5.13,13.42 | v3.86,9.61 v5.13,8.34 v5.14,8.34 | v5.14,8.34 v6.4,7.07 | v5.13,13.42 5.73,14.02 v8.43,14.02 8.76,14.35 9.45,14.35 | v19.9,11.5 21.1,10.3 v21.5,10.3 | v22.2,6.3 22.6,5.9 22.6,5 23.2,4.4 v23.8,4.4 | v36.4,24.7 37.8,24.7 v39.2,26.1 | v36.9,29.3 37.6,29.3 v38.9,30.6 36.8,32.7 v36.8,32.8 | v38.4,38.5 38.2,38.7 v38.2,40.3 | v33.3,40.4 33.4,40.3 v33.4,38.4 32.6,37.6 v31.8,37.6 | v31.8,37.6 33,36.4 v33,35.9 | v16.6,33.5 17.7,32.4 v18,32.4 17.3,31.7 v17.3,30.6 16.2,30.6 v15.5,29.9 15.1,29.5 v13.3,29.5 12.5,30.3 11.7,30.3 11.45,30.55 11.45,31.65 | v16.8,62 18.1,62 v18.7,62.6 18.7,63.7 v19,64 | v20.6,61.6 21.3,60.9 21.3,60.3 | v14.8,7.9 16.1,6.6 16.1,4.4 17.2,3.3 16.85,2.94 15.57,2.94 14.43,4.08 14.43,7.53 v14.8,7.9
  Bottom 0.152: C13.1 16.4,13.2 v16.6,13 | v7.7,54.5 9,55.8 v9.9,55.8 | v7.7,54.5 v9,53.2 | v14.8,7.9 14.7,8 14.7,11.44 14.41,11.73 13,11.73 12.47,11.2 11.7,11.2 | v23,21.1 23,22.6 v23.1,22.7 | v23.1,22.7 23.3,22.7 | v18,14.1 17.55,14.55 17.55,14.65 | v33.3,46 32.4,46.9 30.4,46.9 29.65,47.65 T5.E 29.65,49.3 29.2,49.75 29.2,51.4 R9.1 | v30.3,5.8 30.3,3 v30.5,2.8 31.7,1.6 39.5,1.6 40.64,2.74 v40.64,5.08 | 65.52,9.9 62.98,9.9 GPIO40.25 60.38,9.9 55.3,9.9 GPIO40.20 52.1,13.1 48.4,13.1 GPIO40.14 43.98,13.6 41.3,13.6 38.8,16.1 30.4,16.1 26.5,20 v26,20 | 65.52,9.9 70.6,9.9 GPIO40.34 73.08,9.9 78.2,9.9 79.46,8.64 GPIO40.39 | 9.82,41.22 U$11.#2 | 9.45,45.35 8.69,44.59 C9.1 8.02,44.6 R3.1 7.5,44.6 8.4,45.5 v8.4,45.9 | 35.03,57.17 35.2,57.34 35.2,59.1 37.15,61.05 37.15,61.8 | GPIO40.30 65.52,9.9 | v42,58.5 43.4,58.5 43.8,58.1 | 40.64,52.7 40.64,51.74 40.6,51.7 IC1.2 40.6,51.1 39.95,50.44 C8.1 | v11.6,46.7 11.6,47.2 v13.4,49 | C5.1 38.6,49.73 38.6,49.4 39.2,48.8 40.4,48.8 v40.7,48.5 | 40.64,52.7 40.94,53 41.8,53 42.9,51.9 v43.1,51.9 | v66.04,15.24 v63.5,17.78 | v60.96,15.24 v58.42,17.78 | v55.88,15.24 v53.34,17.78 | v50.8,15.24 v48.26,17.78 | v45.72,15.24 v43.18,17.78 | v40.64,15.24 v38.1,17.78 | v68.58,17.78 v71.12,15.24 | v73.66,17.78 v76.2,15.24 | v58.42,2.54 v60.96,5.08 v63.5,2.54 | v55.88,5.08 v53.34,2.54 | v50.8,5.08 v48.26,2.54 | v45.72,5.08 v43.18,2.54 | v40.64,5.08 v38.1,2.54 | v40.64,5.08 40.64,7.88 GPIO40.9 | v66.04,5.08 v68.58,2.54 | v71.12,5.08 v73.66,2.54 | v76.2,5.08 v78.74,2.54 | v23.1,22.7 23.8,22 v25.9,22 26,21.9 v26,20 | v26,20 25.5,19.5 v23,19.5 | v7.53,9.4 7.33,9.2 5.8,9.2 5.14,8.54 v5.14,8.34 | v2.5,41 2.5,42.6
  Bottom 0.152: 2.5,42.6 2.8,42.9 5.45,42.9 T1.E | 2.5,42.6 2.5,43.4 1.2,44.7 1.2,56.45 2.5,57.75
  pour Bottom (rank 6): -18.5,100.5 95.7,100.5 95.7,-1.5 -18.5,-1.5
  pour Top (rank 6): -18.7,101 96,101 96,-2.9 -18.7,-2.9
GPIO18
  Bottom 0.152: 43.9,10.8 GPIO40.12
GPIO27
  Bottom 0.152: 46.44,7.86 GPIO40.13
LED0
  Bottom 0.152: IC2.6 7.4,33.6 7.8,34 11.1,34 13,32.1 14.1,32.1 15.7,33.7 15.7,39.8 16.1,40.2 R2.1
LED1
  Bottom 0.152: IC2.7 6.75,34.05 7.1,34.4 11.4,34.4 13.2,32.6 13.7,32.6 15.1,34 15.1,43.4 15.4,43.7 R4.1
MOSI2  (via drill 0.35)
  Top 0.152: v17.8,12.3 17.8,13.2 16.7,14.3 16.7,27.55 13.77,30.48 11.22,30.48 9.3,32.4 9.3,35.2 10.44,36.34 LED1.SDO
  Bottom 0.152: SPI-LED.DI 17.7,12.2 v17.8,12.3
MOSI_HV
  Top 0.152: U$9.4 12.13,36.45 LED1.SDI
MOSI_LV
  Top 0.152: U$9.2 18.4,35.8 20.6,33.6 22.15,33.6 U2.P$25
  Top 1.27: U2.P$25 U2.P$11
N$3
  Bottom 0.152: C22.2 12.05,27.5 U7.29
N$5  (via drill 0.35)
  Top 0.152: v12.4,58.7 12.9,58.7 19.3,52.3 32.7,52.3 v35.7,49.3 | U2.P$1 38.72,24.78 37.8,25.7 37.8,36.4 36.2,38 v36.2,39.6
  Top 1.27: U2.P$1 U2.P$15
  Bottom 0.152: v35.7,49.3 35.7,40.1 v36.2,39.6 | v12.4,58.7 10.7,60.4 7.2,60.4 5.94,59.13 U3.7
N$6
  Bottom 0.152: U1.2 12.9,52.72 13.34,53.16 R26.1
N$8  (via drill 0.35)
  Top 0.152: v11.7,57.5 17.9,51.3 31.1,51.3 v32.9,49.5
  Top 1.27: U2.P$2 U2.P$16
  Bottom 0.152: U2.P$2 37.48,27.32 35.8,29 35.8,34.2 34.4,35.6 34.4,48 v32.9,49.5 | U3.6 5.94,57.87 7,56.8 9.2,56.8 9.9,57.5 v11.7,57.5
N$14
  Bottom 0.152: R13.1 12.35,15.5 U7.5
N$16
  Bottom 0.152: U7.27 11.9,26.5 12.1,26.7 13.8,26.7 14.08,26.43 C19.2
N$17
  Bottom 0.152: U7.3 11.61,14.5 11.9,14.2 11.9,13.7 12.4,13.2 C13.2
N$18
  Bottom 0.152: U7.17 12.39,21.5 R31.2
N$21
  Bottom 0.152: C19.1 12.31,26 U7.26
N$22
  Bottom 0.152: U7.28 11.9,27 12,27.1 13.9,27.1 14.1,27.3 C22.1
N$23
  Bottom 0.152: R24.1 18.6,55.2 Q3.G 17.55,54.85 16.9,54.2 16.9,53 16,52.1 13.3,52.1 12.9,51.7 9.6,51.7 7.6,49.7 3.1,49.7 2.85,49.45 R8.1
N$24
  Top 0.152: RCPWR.CATHODE 5.3,38.1 R7.2
N$25
  Bottom 0.152: U7.4 11.71,15 12.1,14.6 C16.2
N$26
  Bottom 0.152: Q3.D 15.95,54.25 15.44,54.76 R26.2
N$27
  Bottom 0.152: 22.16,62.25 Q4.D 22.1,62.05 R27.2
N$28
  Bottom 0.152: U3.3 18.77,57.87 19.6,58.7 19.6,62.7 20.3,63.4 R27.1
N$29
  Bottom 0.152: Q5.D 25.4,63.2 R29.2
N$30
  Bottom 0.152: U3.2 13.57,59.13 12.9,59.8 12.9,61.2 13.7,62 15.4,62 17.4,64 17.4,64.4 18.3,65.3 22.7,65.3 23.91,64.09 R29.1
N$32
  Bottom 0.152: D1.ANODE 16.4,15.9 14.8,17.5 13.95,17.5 C12.2 12.75,19.75 R25.2 13.1,20.6 13.1,20.7 13.3,20.9 13.6,20.9 14.08,21.38 R31.1
N$33
  Bottom 0.152: R34.2 26.2,57.96 R32.1 26.35,58.7 Q5.G
N$37  (via drill 0.35)
  Top 0.152: v8.96,21.7 9,21.74 9,22.9 10.3,24.2 14.7,24.2 v14.9,24
  Bottom 0.152: R36.2 15.7,25.8 R37.1 16.15,25.25 v14.9,24 | U7.16 9.66,21 v8.96,21.7
N$38
  Bottom 0.152: Q4.G 23,59.6 R33.1 R35.2
N$40
  Bottom 0.152: IC1.4 39.04,55.01 C6.2
N$41  (via drill 0.35)
  Top 0.152: v8.7,37.1 8.43,36.83 R1.2
  Bottom 0.152: U$11.#3 8.72,40.87 C3.2 8.72,38.64 IC2.25 v8.7,37.1
N$50
  Bottom 0.152: R19.2 12.4,23 U7.20
NC5
  Top 1.27: U2.P$10 U2.P$24
OE
  Bottom 0.152: IC2.23 7.4,39.6 6.7,40.3 | 6.7,40.3 T1.C | R14.1 7.1,43 R3.2 7.4,40.8 6.9,40.3 6.7,40.3
PCH1  (via drill 0.35)
  Top 0.152: U$1.7:SIGNAL1 18.02,44.98 v17,46
  Bottom 0.152: v17,46 16.97,46 16.35,46.62 R12.1
PCH2  (via drill 0.35)
  Top 0.152: U$1.4:SIGNAL2 v10.4,46.1
  Bottom 0.152: R11.1 v10.4,46.1
PCH3_XAIO  (via drill 0.35)
  Top 0.152: v35.8,35.8 34.8,35.8 32.4,38.2 v32.4,39.7 | v24.3,45.7 22.5,45.7 22.1,45.3 22.1,41.7 21.4,41 17.5,41 17,41.51 11.41,41.51 9.7,39.8 9.7,38.5 9.4,38.2 7.3,38.2 6.5,39 6.5,45.7 v6.6,45.8 | v5.5,48.8 5.5,52.8 v5.8,53.1
  Top 1.27: U2.P$3 U2.P$17
  Bottom 0.152: R6.1 4.2,52.55 4.28,52.63 | 4.28,52.63 U1.3 | U2.P$3 35.8,35.19 v35.8,35.8 | v32.4,39.7 26.4,45.7 v24.3,45.7 | v6.6,45.8 5.5,46.9 v5.5,48.8 | v5.8,53.1 5.33,52.63 4.28,52.63
PCH_3  (via drill 0.35)
  Top 0.152: U$1.1:SIGNAL3 2.78,45.82 v2.7,45.9
  Bottom 0.152: v2.7,45.9 2.7,47 R8.2
RC_CH1_ST  (via drill 0.35)
  Top 0.152: U$1.11:ST_SIGNAL 28.18,45.98 v28.2,46
  Bottom 0.152: v28.2,46 28.2,47.09 R20.2
RC_CH2_TH  (via drill 0.35)
  Top 0.152: U$1.15:TH_SINGNAL 38.34,45.86 v38.3,45.9
  Bottom 0.152: v38.3,45.9 38.28,45.92 R21.2
RCH1
  Bottom 0.152: U$3.4 31.97,54.6 30.4,54.6 30,54.2 28.2,54.2 27.4,53.4 27.4,51.7 27.9,51.2 27.9,49.05 R20.1 28.03,48.92
RCH2
  Bottom 0.152: R21.1 38.28,48.62 36.5,50.39 36.5,52.7 36.1,53.1 36.1,55.1 34.68,56.52 U$3.7
RECV_CH1  (via drill 0.35)
  Top 0.152: v30.5,53.6 30.3,53.4 v24.6,53.4 | v24.3,55.1 24.3,55 v22.7,53.4
  Bottom 0.152: v24.6,53.4 v22.7,53.4 22.1,53.4 18.8,50.1 16.9,50.1 16.35,49.55 R12.2 | R34.1 25.07,55.87 v24.3,55.1 | v30.5,53.6 30.82,53.92 U$3.3
RECV_CH2  (via drill 0.35)
  Top 0.152: v29.1,55.9 26.9,55.9 25.7,57.1 24.5,57.1 v24.2,56.8
  Bottom 0.152: R11.2 10.4,50 11.12,50.72 12.08,50.72 12.9,49.9 15.6,49.9 16.42,50.72 18.48,50.72 23.01,55.25 R35.1 23.35,55.85 24.2,56.7 v24.2,56.8 | U$3.6 29.13,55.87 v29.1,55.9
SCL  (via drill 0.35)
  Top 0.152: v31.3,59.4 32.8,57.9 34.4,57.9 37.5,61 37.5,64.6 37.45,64.65 | 37.45,64.65 33.6,68.5 15.5,68.5 3.2,56.2 3.2,47.49 3.72,46.97 3.72,41.31 2.5,40.09 2.5,38.6 3.7,37.4 3.7,36.5 3.56,36.36 v3.56,34.3 3.6,34.26 v3.6,30.3 | v15.8,3.5 17.4,1.9 31,1.9 v32.2,3.1 | v7.8,18.1 7.4,17.7 7.4,13.6 8.1,12.9 9.2,12.9 13.2,8.9 13.2,7.4 14.4,6.2 15,6.2 v15.1,6.3 | v42.2,63.7 40.5,65.4 38.2,65.4 37.45,64.65
  Top 1.27: U2.P$6 U2.P$20
  Bottom 0.152: I2C.SCL 31.15,59.55 v31.3,59.4 | R22.1 36.08,8.39 GPIO40.5 | R22.1 36.02,3.52 | IC2.26 9.35,36.26 8.9,35.8 5.06,35.8 v3.56,34.3 | v15.8,3.5 15.1,4.2 v15.1,6.3 | U7.13 9.2,19.5 v7.8,18.1 7,18.9 7,21.6 5.1,23.5 5.1,28.3 3.6,29.8 v3.6,30.3 | U2.P$6 39.82,37.48 39.6,37.7 39.6,41.8 42.3,44.5 42.3,45.8 42.2,45.9 42.2,46.2 44.8,48.79 44.8,58.01 41.4,61.4 41.4,62.4 42.2,63.2 v42.2,63.7 | v32.2,3.1 33.4,3.1 34,2.5 35.4,2.5 36.08,3.17 R22.1
SDA  (via drill 0.35)
  Top 0.152: U2.P$5 40.93,34.94 | v33.7,55.5 33.1,56.1 30,56.1 26.4,59.7 26.4,63.9 28.6,66.1 | 28.6,66.1 v32.5,66.1 | 28.6,66.1 27.8,66.9 17,66.9 4.38,54.28 4.38,35.2 v5.28,34.3 4.9,33.92 v4.9,29.8 | v17.7,4 17.9,4 18.3,3.6 30.2,3.6 v31.4,4.8 | v16.8,7 8.7,15.1 v8.7,15.9 8.7,19.3 7.9,20.1 v7.9,23
  Top 1.27: U2.P$5 U2.P$19
  Bottom 0.152: v32.5,66.1 33.15,65.45 I2C.SDA | R23.1 32.73,5.35 32.73,7.59 GPIO40.3 | R23.1 33.03,4.93 | IC2.27 10,35.9 9.2,35.1 6.08,35.1 v5.28,34.3 | U7.12 11.81,19 11.9,18.9 11.9,18.6 11.8,18.5 U7.11 9.4,18.5 8.7,17.8 v8.7,15.9 | v17.7,4 16.8,4.9 v16.8,7 | v7.9,23 7.9,23.2 5.9,25.2 5.9,28.8 v4.9,29.8 | U2.P$5 39.6,36.47 39.6,36.5 39,37.1 38.3,37.1 37.2,38.2 37.2,38.9 37.6,39.3 37.6,39.9 37.1,40.4 37.1,49.1 35.9,50.3 35.9,52.5 35.6,52.8 35.6,54.7 34.8,55.5 v33.7,55.5 | R23.1 31.66,5.05 v31.4,4.8
SIGNAL_SELECT  (via drill 0.35)
  Top 0.152: v36.2,57.2 36.2,55.3 35.9,55 34.4,55 33.5,54.1 33.5,53.2 v34.2,52.5
  Bottom 0.152: 30.5,52 30.5,51.1 T5.C 30.97,51.47 R10.2 34.2,52.23 v34.2,52.5 | U$3.1 31.12,52.62 30.5,52 | R5.1 36.2,58.6 v36.2,57.2 | R9.2 29.7,53.2 30.5,52.4 30.5,52
XAIO_5V
  Top 0.508: D3.K 30.6,15.3 27.6,18.3 25.5,18.3 24.5,19.3 24.5,23.63 U2.P$28
  Top 1.27: U2.P$14 U2.P$28
XAIO_SIGNAL_SELCET
  Top 1.27: U2.P$4 U2.P$18
  Bottom 0.152: U2.P$4 34.9,38.63 34.9,48.5 34.2,49.2 34.2,49.7 34.7,50.2 R10.1 33.27,50.33 32.8,50.8 32.1,50.8 31.55,50.25 T5.B
XIAO_3V3
  Top 1.27: U2.P$12 U2.P$26
XIAO_RX
  Top 1.27: U2.P$22 U2.P$8
XIAO_TX
  Top 1.27: U2.P$7 U2.P$21

### Text on the board
tPlace: ST | TH | ch | 3 | ch | 2 | ch | 1 | Not connect | Not connect | VCC | VCC | VCC | VCC | VCC | SIGNAL | SIGNAL | SIGNAL | SIGNAL | SIGNAL | D7 | D0 | #612 | 20 | 30 | 40 | 1 | 9 | 19 | 29 | 39 | Rev 3.0.9
bPlace: SCL | SDA | 5V | GND | D10 | 3V3 | GND | VUSB | Rev 3.0.9 B | F-612-3-0-9-A-N-J-2-WAY | MOSI | GND | CLK | 5V | S/N
Document: Jetson Nano DevKit / B-01 (A02) | #612 JetRacer Rev 3.0.9 B / 2024/11/29 / Jetson Nano compatible
_tNames: Servo | Receiver | I2C-CON | ESC | Jetson Nano Border | TLP2270 | MC74VHC157 | TLP291 | LP2985-33DBVR | CUS05F40 | KC2016Z(25MHz,OSC) | Not Used | Not Used | PCA9685PW | XIAO ESP32S3 | AP102-202 | 0.96inchOLED(Blue) | Jetson Orin Nano / Users Hole | CUHS20S30 | SPI-LED CON